# Altium project IFAT6.PrjPcb (part 2 of 3)

## Sheet Power.SchDoc: Power
size 762 x 381 mm; DrawnBy: Soumil Jain
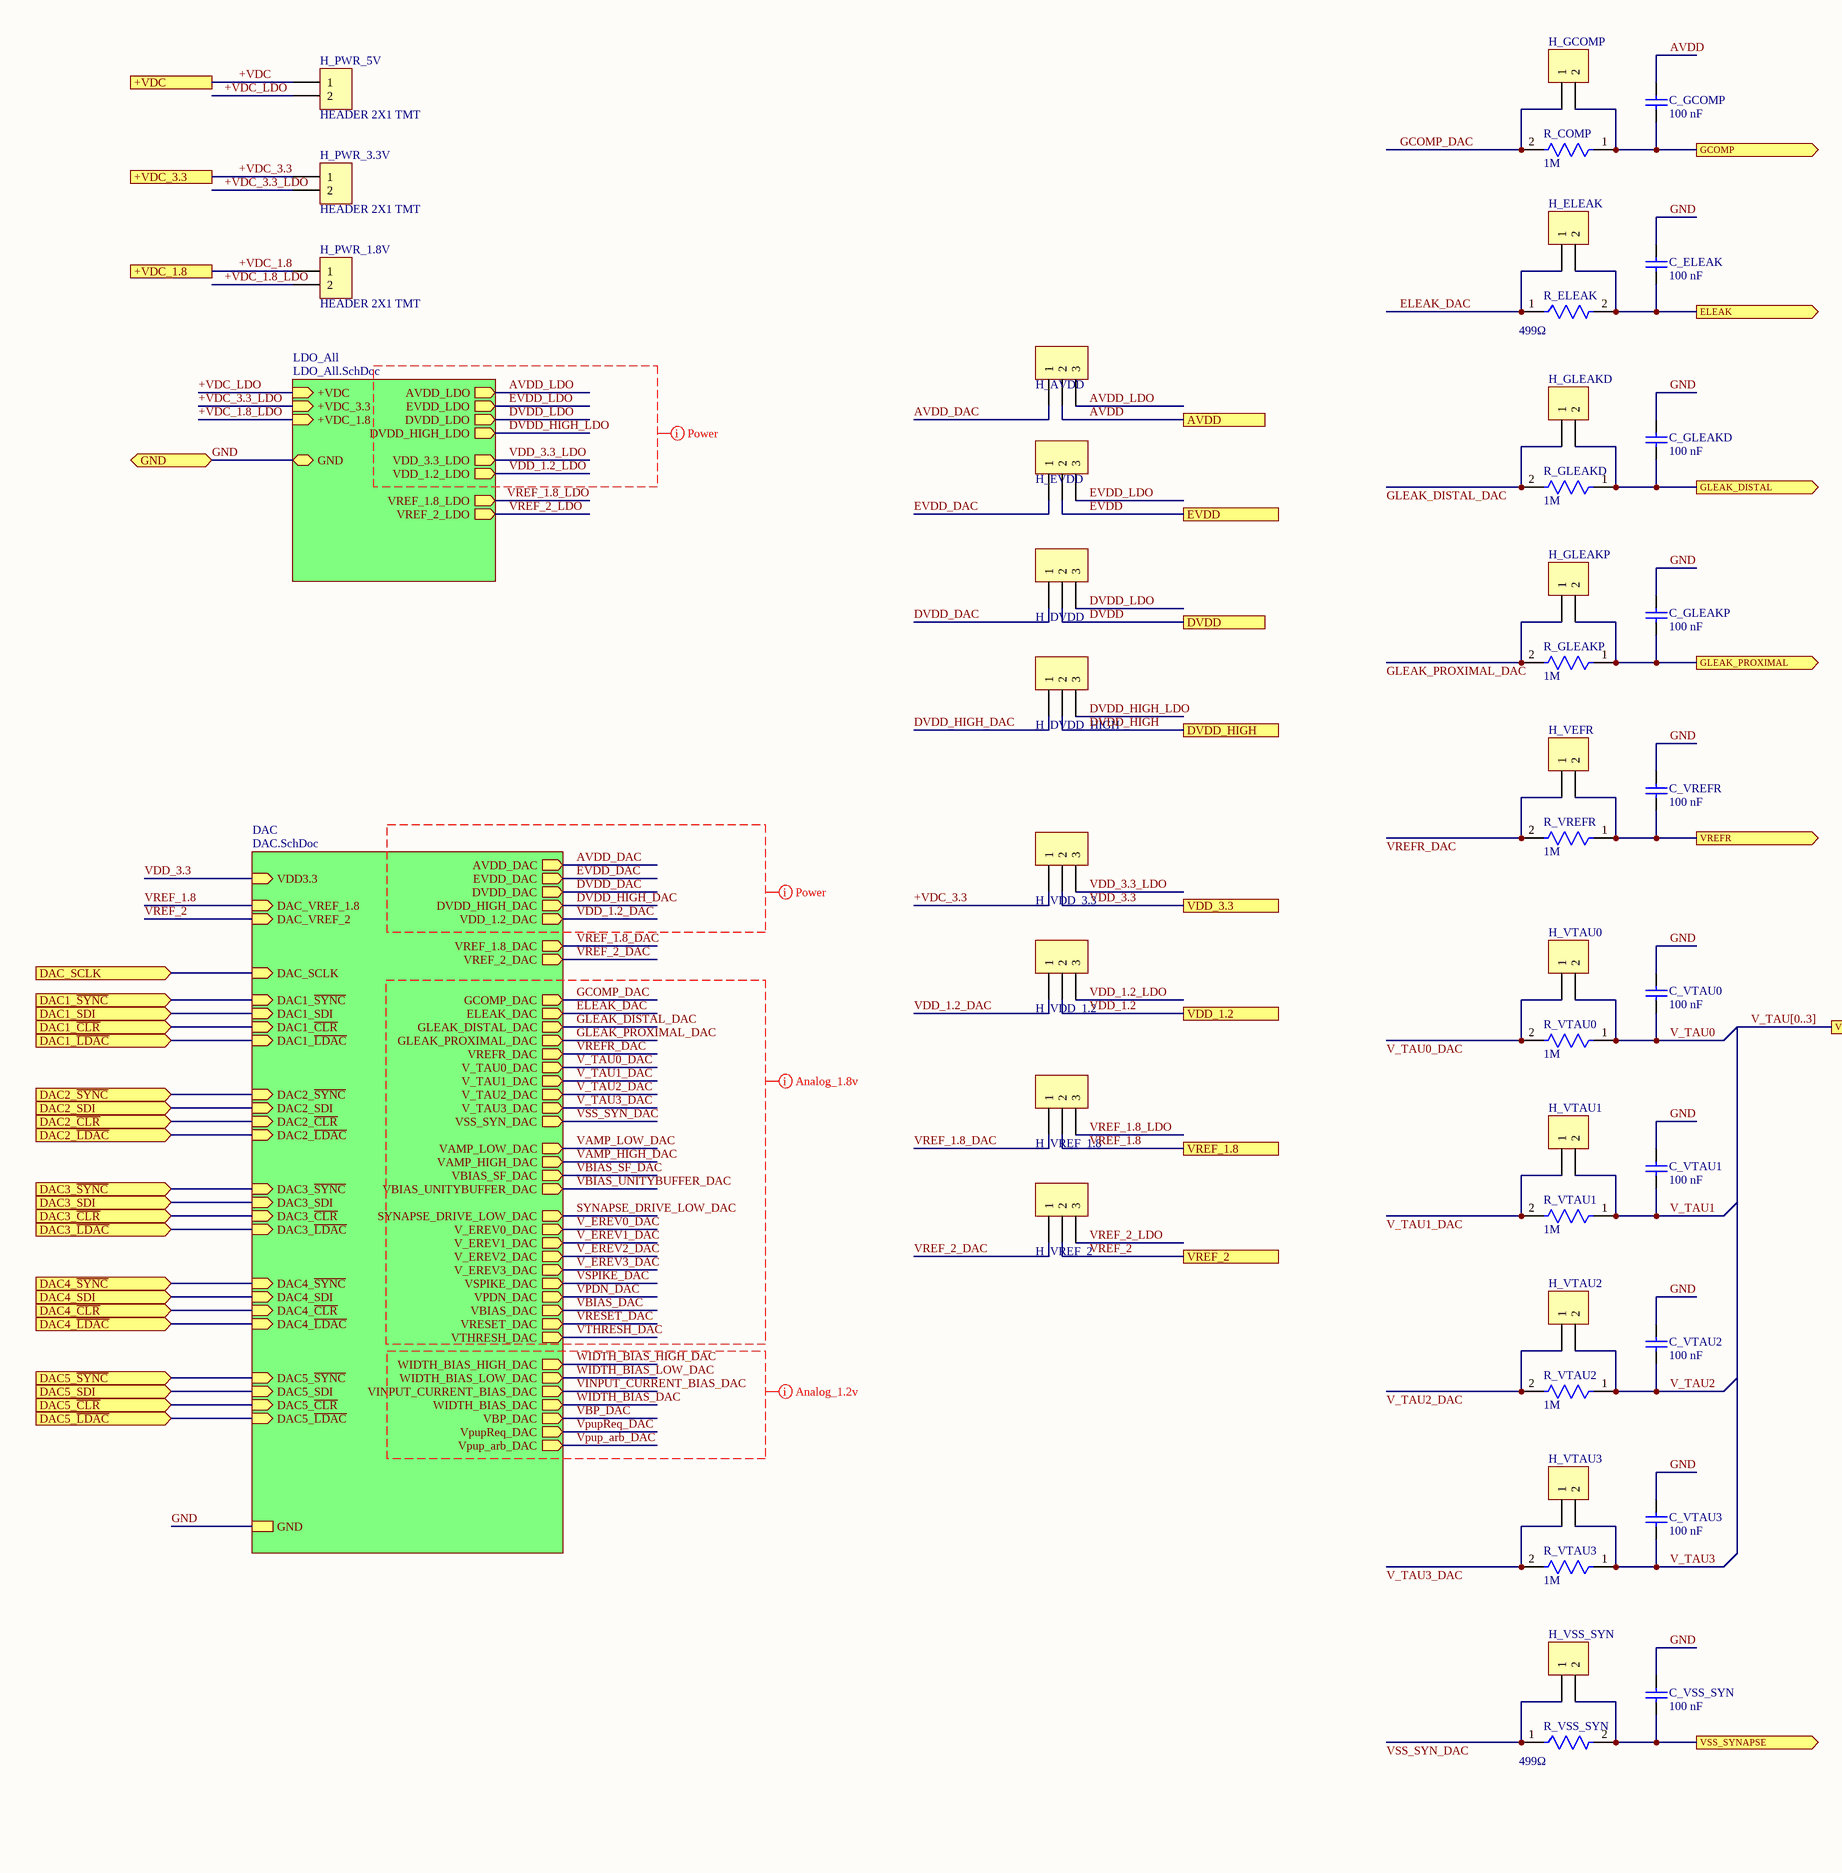
[diagram p4: Power.SchDoc, left]
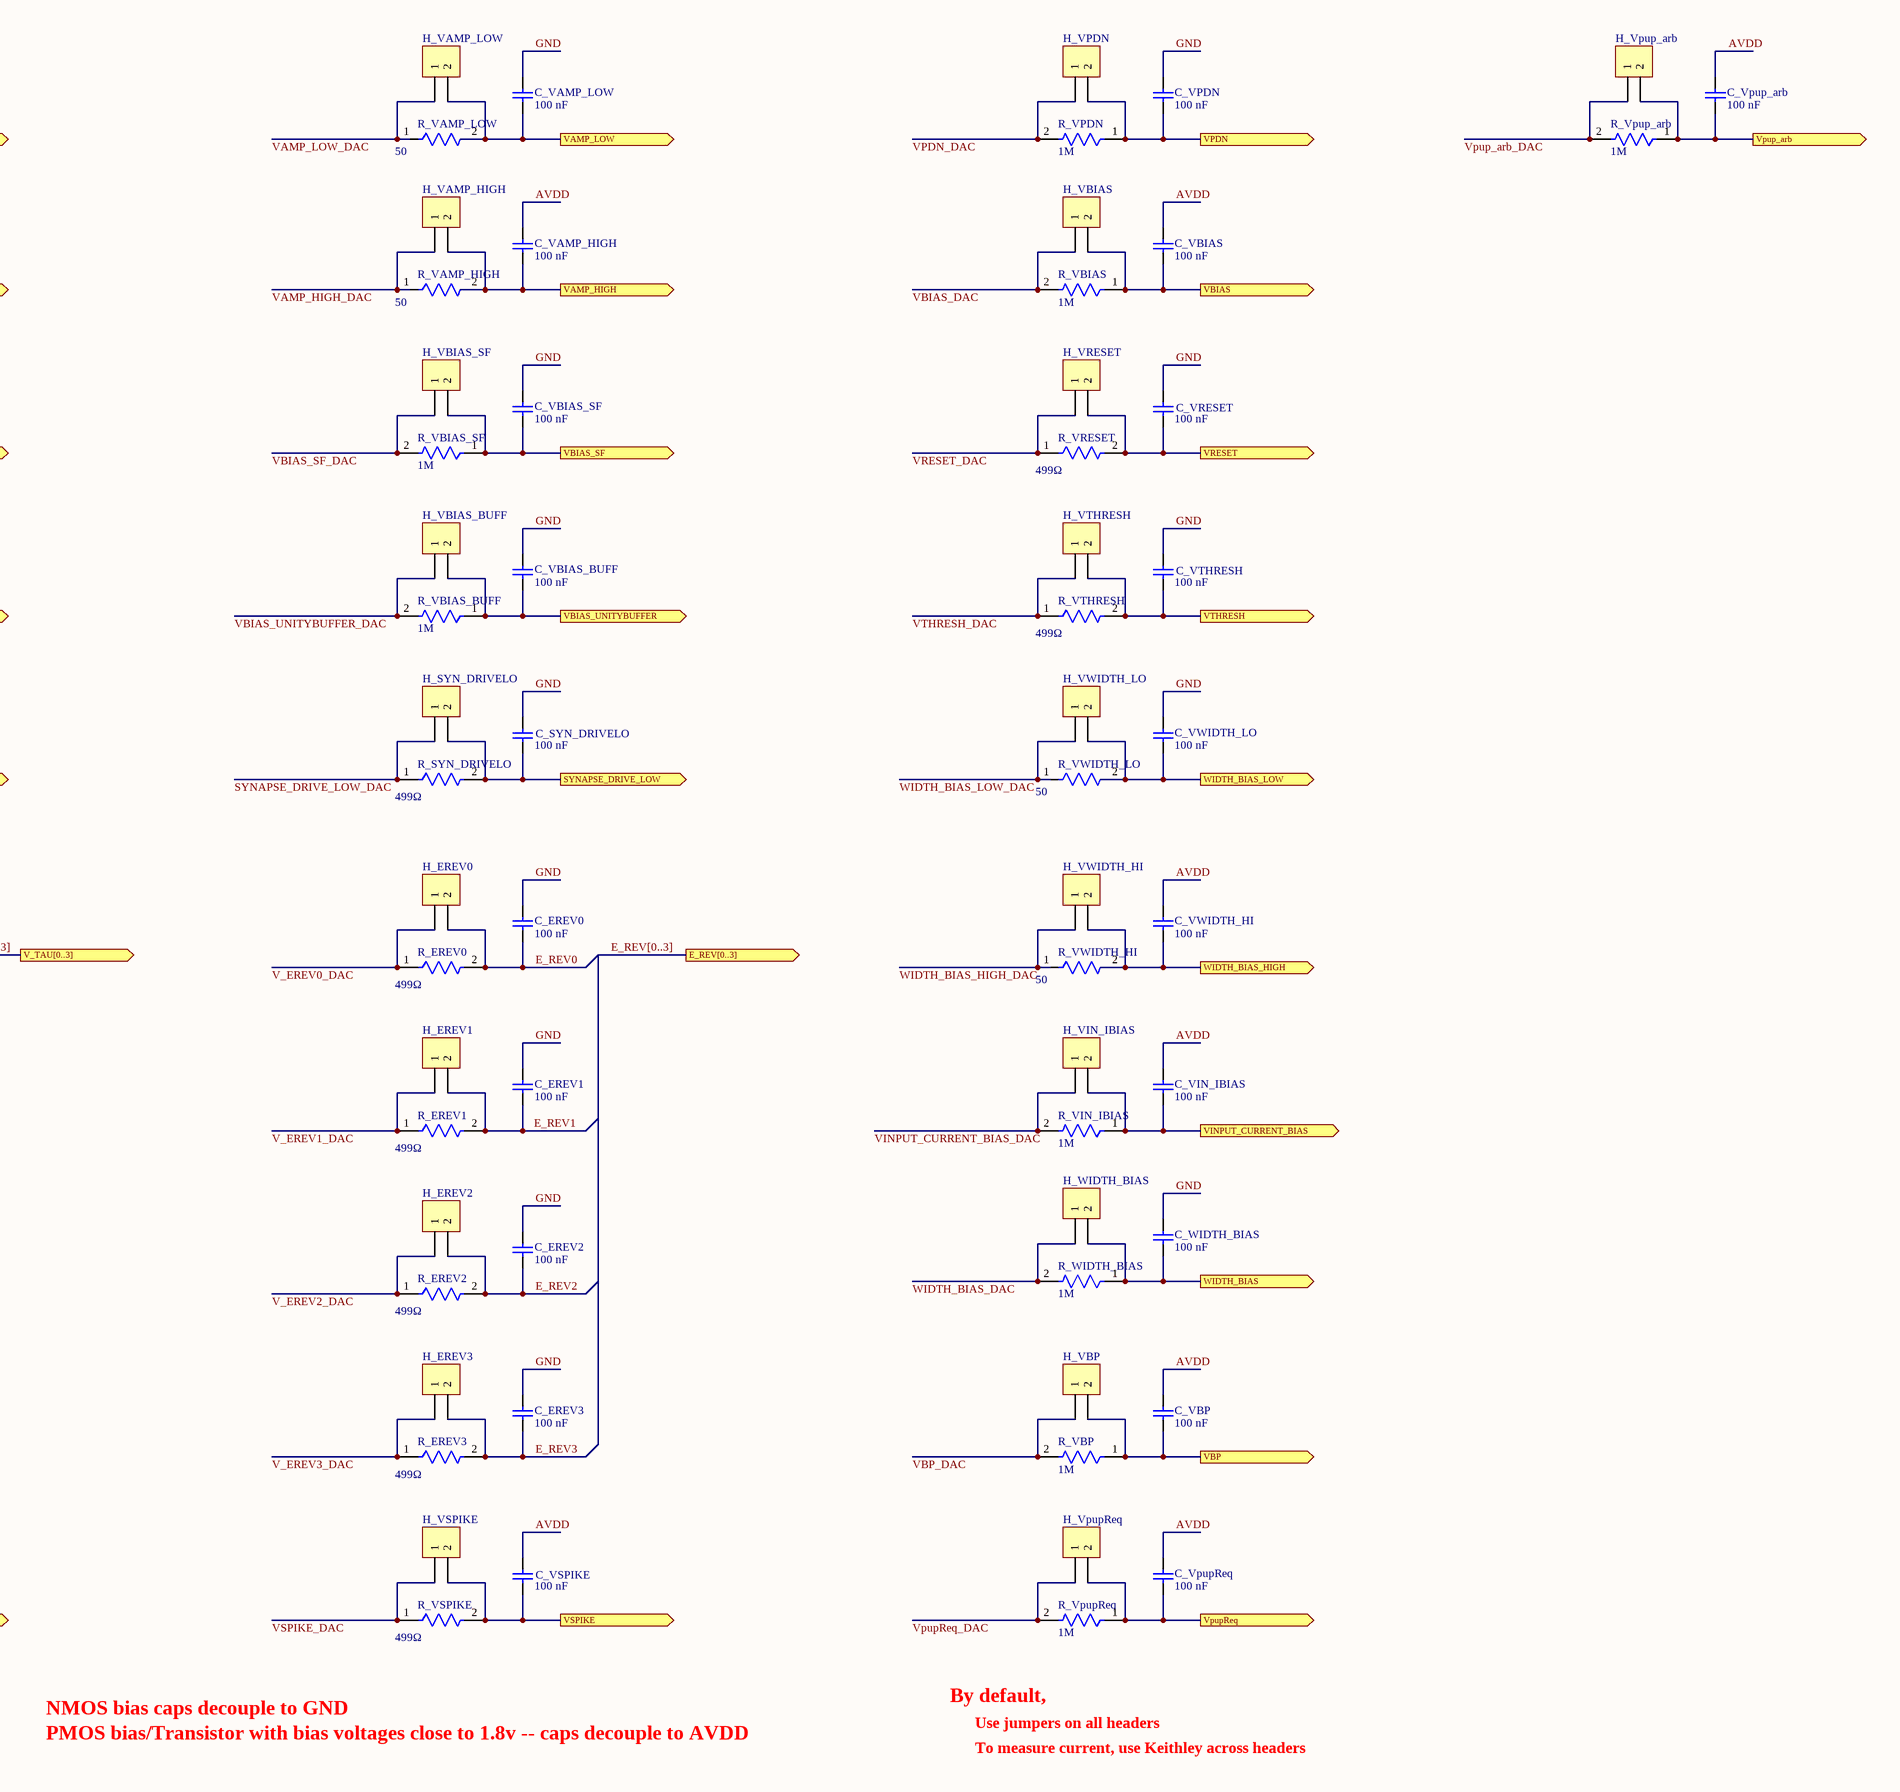
[diagram p5: Power.SchDoc, right]

### Parts
C_ELEAK  value 100 nF  [KEMET C0805C104J8RACTU]  (hidden comment: Cap 100nF 0805)
C_EREV0  value 100 nF  [KEMET C0805C104J8RACTU]  (hidden comment: Cap 100nF 0805)
C_EREV1  value 100 nF  [KEMET C0805C104J8RACTU]  (hidden comment: Cap 100nF 0805)
C_EREV2  value 100 nF  [KEMET C0805C104J8RACTU]  (hidden comment: Cap 100nF 0805)
C_EREV3  value 100 nF  [KEMET C0805C104J8RACTU]  (hidden comment: Cap 100nF 0805)
C_GCOMP  value 100 nF  [KEMET C0805C104J8RACTU]  (hidden comment: Cap 100nF 0805)
C_GLEAKD  value 100 nF  [KEMET C0805C104J8RACTU]  (hidden comment: Cap 100nF 0805)
C_GLEAKP  value 100 nF  [KEMET C0805C104J8RACTU]  (hidden comment: Cap 100nF 0805)
C_SYN_DRIVELO  value 100 nF  [KEMET C0805C104J8RACTU]  (hidden comment: Cap 100nF 0805)
C_VAMP_HIGH  value 100 nF  [KEMET C0805C104J8RACTU]  (hidden comment: Cap 100nF 0805)
C_VAMP_LOW  value 100 nF  [KEMET C0805C104J8RACTU]  (hidden comment: Cap 100nF 0805)
C_VBIAS  value 100 nF  [KEMET C0805C104J8RACTU]  (hidden comment: Cap 100nF 0805)
C_VBIAS_BUFF  value 100 nF  [KEMET C0805C104J8RACTU]  (hidden comment: Cap 100nF 0805)
C_VBIAS_SF  value 100 nF  [KEMET C0805C104J8RACTU]  (hidden comment: Cap 100nF 0805)
C_VBP  value 100 nF  [KEMET C0805C104J8RACTU]  (hidden comment: Cap 100nF 0805)
C_VIN_IBIAS  value 100 nF  [KEMET C0805C104J8RACTU]  (hidden comment: Cap 100nF 0805)
C_VPDN  value 100 nF  [KEMET C0805C104J8RACTU]  (hidden comment: Cap 100nF 0805)
C_Vpup_arb  value 100 nF  [KEMET C0805C104J8RACTU]  (hidden comment: Cap 100nF 0805)
C_VpupReq  value 100 nF  [KEMET C0805C104J8RACTU]  (hidden comment: Cap 100nF 0805)
C_VREFR  value 100 nF  [KEMET C0805C104J8RACTU]  (hidden comment: Cap 100nF 0805)
C_VRESET  value 100 nF  [KEMET C0805C104J8RACTU]  (hidden comment: Cap 100nF 0805)
C_VSPIKE  value 100 nF  [KEMET C0805C104J8RACTU]  (hidden comment: Cap 100nF 0805)
C_VSS_SYN  value 100 nF  [KEMET C0805C104J8RACTU]  (hidden comment: Cap 100nF 0805)
C_VTAU0  value 100 nF  [KEMET C0805C104J8RACTU]  (hidden comment: Cap 100nF 0805)
C_VTAU1  value 100 nF  [KEMET C0805C104J8RACTU]  (hidden comment: Cap 100nF 0805)
C_VTAU2  value 100 nF  [KEMET C0805C104J8RACTU]  (hidden comment: Cap 100nF 0805)
C_VTAU3  value 100 nF  [KEMET C0805C104J8RACTU]  (hidden comment: Cap 100nF 0805)
C_VTHRESH  value 100 nF  [KEMET C0805C104J8RACTU]  (hidden comment: Cap 100nF 0805)
C_VWIDTH_HI  value 100 nF  [KEMET C0805C104J8RACTU]  (hidden comment: Cap 100nF 0805)
C_VWIDTH_LO  value 100 nF  [KEMET C0805C104J8RACTU]  (hidden comment: Cap 100nF 0805)
C_WIDTH_BIAS  value 100 nF  [KEMET C0805C104J8RACTU]  (hidden comment: Cap 100nF 0805)
H_AVDD  HEADER 3X1 TMT  [Samtec TSW-103-07-L-S]  (value not drawn)
H_DVDD  HEADER 3X1 TMT  [Samtec TSW-103-07-L-S]  (value not drawn)
H_DVDD_HIGH  HEADER 3X1 TMT  [Samtec TSW-103-07-L-S]  (value not drawn)
H_ELEAK  HEADER 2X1 TMT  [Samtec TSW-102-07-G-S]  (value not drawn)
H_EREV0  HEADER 2X1 TMT  [Samtec TSW-102-07-G-S]  (value not drawn)
H_EREV1  HEADER 2X1 TMT  [Samtec TSW-102-07-G-S]  (value not drawn)
H_EREV2  HEADER 2X1 TMT  [Samtec TSW-102-07-G-S]  (value not drawn)
H_EREV3  HEADER 2X1 TMT  [Samtec TSW-102-07-G-S]  (value not drawn)
H_EVDD  HEADER 3X1 TMT  [Samtec TSW-103-07-L-S]  (value not drawn)
H_GCOMP  HEADER 2X1 TMT  [Samtec TSW-102-07-G-S]  (value not drawn)
H_GLEAKD  HEADER 2X1 TMT  [Samtec TSW-102-07-G-S]  (value not drawn)
H_GLEAKP  HEADER 2X1 TMT  [Samtec TSW-102-07-G-S]  (value not drawn)
H_PWR_1.8V  HEADER 2X1 TMT  [Samtec TSW-102-07-G-S]
H_PWR_3.3V  HEADER 2X1 TMT  [Samtec TSW-102-07-G-S]
H_PWR_5V  HEADER 2X1 TMT  [Samtec TSW-102-07-G-S]
H_SYN_DRIVELO  HEADER 2X1 TMT  [Samtec TSW-102-07-G-S]  (value not drawn)
H_VAMP_HIGH  HEADER 2X1 TMT  [Samtec TSW-102-07-G-S]  (value not drawn)
H_VAMP_LOW  HEADER 2X1 TMT  [Samtec TSW-102-07-G-S]  (value not drawn)
H_VBIAS  HEADER 2X1 TMT  [Samtec TSW-102-07-G-S]  (value not drawn)
H_VBIAS_BUFF  HEADER 2X1 TMT  [Samtec TSW-102-07-G-S]  (value not drawn)
H_VBIAS_SF  HEADER 2X1 TMT  [Samtec TSW-102-07-G-S]  (value not drawn)
H_VBP  HEADER 2X1 TMT  [Samtec TSW-102-07-G-S]  (value not drawn)
H_VDD_1.2  HEADER 3X1 TMT  [Samtec TSW-103-07-L-S]  (value not drawn)
H_VDD_3.3  HEADER 3X1 TMT  [Samtec TSW-103-07-L-S]  (value not drawn)
H_VEFR  HEADER 2X1 TMT  [Samtec TSW-102-07-G-S]  (value not drawn)
H_VIN_IBIAS  HEADER 2X1 TMT  [Samtec TSW-102-07-G-S]  (value not drawn)
H_VPDN  HEADER 2X1 TMT  [Samtec TSW-102-07-G-S]  (value not drawn)
H_Vpup_arb  HEADER 2X1 TMT  [Samtec TSW-102-07-G-S]  (value not drawn)
H_VpupReq  HEADER 2X1 TMT  [Samtec TSW-102-07-G-S]  (value not drawn)
H_VREF_1.8  HEADER 3X1 TMT  [Samtec TSW-103-07-L-S]  (value not drawn)
H_VREF_2  HEADER 3X1 TMT  [Samtec TSW-103-07-L-S]  (value not drawn)
H_VRESET  HEADER 2X1 TMT  [Samtec TSW-102-07-G-S]  (value not drawn)
H_VSPIKE  HEADER 2X1 TMT  [Samtec TSW-102-07-G-S]  (value not drawn)
H_VSS_SYN  HEADER 2X1 TMT  [Samtec TSW-102-07-G-S]  (value not drawn)
H_VTAU0  HEADER 2X1 TMT  [Samtec TSW-102-07-G-S]  (value not drawn)
H_VTAU1  HEADER 2X1 TMT  [Samtec TSW-102-07-G-S]  (value not drawn)
H_VTAU2  HEADER 2X1 TMT  [Samtec TSW-102-07-G-S]  (value not drawn)
H_VTAU3  HEADER 2X1 TMT  [Samtec TSW-102-07-G-S]  (value not drawn)
H_VTHRESH  HEADER 2X1 TMT  [Samtec TSW-102-07-G-S]  (value not drawn)
H_VWIDTH_HI  HEADER 2X1 TMT  [Samtec TSW-102-07-G-S]  (value not drawn)
H_VWIDTH_LO  HEADER 2X1 TMT  [Samtec TSW-102-07-G-S]  (value not drawn)
H_WIDTH_BIAS  HEADER 2X1 TMT  [Samtec TSW-102-07-G-S]  (value not drawn)
R_COMP  1M  [FP-CRCW0603-e3-MFG]
R_ELEAK  Resistance: 499Ω  [FP-RP73P-1J-MFG]  (hidden comment: RP73PF1J499RBTDF)
R_EREV0  Resistance: 499Ω  [FP-RP73P-1J-MFG]  (hidden comment: RP73PF1J499RBTDF)
R_EREV1  Resistance: 499Ω  [FP-RP73P-1J-MFG]  (hidden comment: RP73PF1J499RBTDF)
R_EREV2  Resistance: 499Ω  [FP-RP73P-1J-MFG]  (hidden comment: RP73PF1J499RBTDF)
R_EREV3  Resistance: 499Ω  [FP-RP73P-1J-MFG]  (hidden comment: RP73PF1J499RBTDF)
R_GLEAKD  1M  [FP-CRCW0603-e3-MFG]
R_GLEAKP  1M  [FP-CRCW0603-e3-MFG]
R_SYN_DRIVELO  Resistance: 499Ω  [FP-RP73P-1J-MFG]  (hidden comment: RP73PF1J499RBTDF)
R_VAMP_HIGH  RESISTANCE: 50  [FP-RN731E-IPC_A]  (hidden comment: RN731ETTP50R0F50)
R_VAMP_LOW  RESISTANCE: 50  [FP-RN731E-IPC_A]  (hidden comment: RN731ETTP50R0F50)
R_VBIAS  1M  [FP-CRCW0603-e3-MFG]
R_VBIAS_BUFF  1M  [FP-CRCW0603-e3-MFG]
R_VBIAS_SF  1M  [FP-CRCW0603-e3-MFG]
R_VBP  1M  [FP-CRCW0603-e3-MFG]
R_VIN_IBIAS  1M  [FP-CRCW0603-e3-MFG]
R_VPDN  1M  [FP-CRCW0603-e3-MFG]
R_Vpup_arb  1M  [FP-CRCW0603-e3-MFG]
R_VpupReq  1M  [FP-CRCW0603-e3-MFG]
R_VREFR  1M  [FP-CRCW0603-e3-MFG]
R_VRESET  Resistance: 499Ω  [FP-RP73P-1J-MFG]  (hidden comment: RP73PF1J499RBTDF)
R_VSPIKE  Resistance: 499Ω  [FP-RP73P-1J-MFG]  (hidden comment: RP73PF1J499RBTDF)
R_VSS_SYN  Resistance: 499Ω  [FP-RP73P-1J-MFG]  (hidden comment: RP73PF1J499RBTDF)
R_VTAU0  1M  [FP-CRCW0603-e3-MFG]
R_VTAU1  1M  [FP-CRCW0603-e3-MFG]
R_VTAU2  1M  [FP-CRCW0603-e3-MFG]
R_VTAU3  1M  [FP-CRCW0603-e3-MFG]
R_VTHRESH  Resistance: 499Ω  [FP-RP73P-1J-MFG]  (hidden comment: RP73PF1J499RBTDF)
R_VWIDTH_HI  RESISTANCE: 50  [FP-RN731E-IPC_A]  (hidden comment: RN731ETTP50R0F50)
R_VWIDTH_LO  RESISTANCE: 50  [FP-RN731E-IPC_A]  (hidden comment: RN731ETTP50R0F50)
R_WIDTH_BIAS  1M  [FP-CRCW0603-e3-MFG]

### Sub-sheets
DAC = DAC.SchDoc: DAC1_~{SYNC} (in), DAC_SCLK (in), DAC1_SDI (in), VDD3.3 (in), DAC_VREF_1.8 (in), EVDD_DAC (out), DAC1_~{CLR} (in), DAC1_~{LDAC} (in), GND, DAC2_~{SYNC} (in), DAC2_SDI (in), DAC2_~{CLR} (in), DAC2_~{LDAC} (in), AVDD_DAC (out), DVDD_DAC (out), DVDD_HIGH_DAC (out), VREF_1.8_DAC (out), GCOMP_DAC (out), ELEAK_DAC (out), GLEAK_DISTAL_DAC (out), GLEAK_PROXIMAL_DAC (out), VREFR_DAC (out), V_TAU0_DAC (out), V_TAU1_DAC (out), V_TAU2_DAC (out), V_TAU3_DAC (out), VSS_SYN_DAC (out), VAMP_LOW_DAC (out), VAMP_HIGH_DAC (out), VBIAS_SF_DAC (out), VBIAS_UNITYBUFFER_DAC (out), SYNAPSE_DRIVE_LOW_DAC (out), V_EREV0_DAC (out), V_EREV2_DAC (out), V_EREV1_DAC (out), V_EREV3_DAC (out), VSPIKE_DAC (out), VPDN_DAC (out), VBIAS_DAC (out), VRESET_DAC (out), VTHRESH_DAC (out), WIDTH_BIAS_HIGH_DAC (out), WIDTH_BIAS_LOW_DAC (out), VINPUT_CURRENT_BIAS_DAC (out), WIDTH_BIAS_DAC (out), VBP_DAC (out), VpupReq_DAC (out), Vpup_arb_DAC (out), DAC3_~{SYNC} (in), DAC3_SDI (in), DAC3_~{CLR} (in), DAC3_~{LDAC} (in), DAC_VREF_2 (in), VREF_2_DAC (out), DAC4_~{SYNC} (in), DAC4_SDI (in), DAC4_~{CLR} (in), DAC4_~{LDAC} (in), DAC5_~{LDAC} (in), DAC5_SDI (in), DAC5_~{SYNC} (in), DAC5_~{CLR} (in), VDD_1.2_DAC (out)
LDO_All = LDO_All.SchDoc: +VDC (in), GND (bidir), AVDD_LDO (out), DVDD_HIGH_LDO (out), EVDD_LDO (out), +VDC_3.3 (in), +VDC_1.8 (in), DVDD_LDO (out), VDD_3.3_LDO (out), VREF_1.8_LDO (out), VREF_2_LDO (out), VDD_1.2_LDO (out)

### Ports
+VDC, +VDC_1.8, +VDC_3.3, AVDD, DAC1_SDI (in), DAC1_~{CLR} (in), DAC1_~{LDAC} (in), DAC1_~{SYNC} (in), DAC2_SDI (in), DAC2_~{CLR} (in), DAC2_~{LDAC} (in), DAC2_~{SYNC} (in), DAC3_SDI (in), DAC3_~{CLR} (in), DAC3_~{LDAC} (in), DAC3_~{SYNC} (in), DAC4_SDI (in), DAC4_~{CLR} (in), DAC4_~{LDAC} (in), DAC4_~{SYNC} (in), DAC5_SDI (in), DAC5_~{CLR} (in), DAC5_~{LDAC} (in), DAC5_~{SYNC} (in), DAC_SCLK (in), DVDD, DVDD_HIGH, E_REV[0..3] (out), ELEAK (out), EVDD, GCOMP (out), GLEAK_DISTAL (out), GLEAK_PROXIMAL (out), GND (bidir), SYNAPSE_DRIVE_LOW (out), V_TAU[0..3] (out), VAMP_HIGH (out), VAMP_LOW (out), VBIAS (out), VBIAS_SF (out), VBIAS_UNITYBUFFER (out), VBP (out), VDD_1.2, VDD_3.3, VINPUT_CURRENT_BIAS (out), VPDN (out), Vpup_arb (out), VpupReq (out), VREF_1.8, VREF_2, VREFR (out), VRESET (out), VSPIKE (out), VSS_SYNAPSE (out), VTHRESH (out), WIDTH_BIAS (out), WIDTH_BIAS_HIGH (out), WIDTH_BIAS_LOW (out)

### Nets
+VDC: H_PWR_5V.1 ; port +VDC
+VDC_1.8: H_PWR_1.8V.1 ; port +VDC_1.8
+VDC_3.3: H_PWR_3.3V.1 H_VDD_3.3.1 ; port +VDC_3.3
GND: C_ELEAK.1 C_EREV0.1 C_EREV1.1 C_EREV2.1 C_EREV3.1 C_GLEAKD.1 C_GLEAKP.1 C_SYN_DRIVELO.1 C_VAMP_LOW.1 C_VBIAS_BUFF.1 C_VBIAS_SF.1 C_VPDN.1 C_VREFR.1 C_VRESET.1 C_VSS_SYN.1 C_VTAU0.1 C_VTAU1.1 C_VTAU2.1 C_VTAU3.1 C_VTHRESH.1 C_VWIDTH_LO.1 C_WIDTH_BIAS.1 ; port GND, sheet LDO_All/GND, sheet DAC/GND  [project net DGND]
VDD_1.2: H_VDD_1.2.2 ; port VDD_1.2  [project net VCCO_MC1]
+VDC_1.8_LDO: H_PWR_1.8V.2 ; sheet LDO_All/+VDC_1.8
+VDC_3.3_LDO: H_PWR_3.3V.2 ; sheet LDO_All/+VDC_3.3
+VDC_LDO: H_PWR_5V.2 ; sheet LDO_All/+VDC
AVDD: C_GCOMP.1 C_VAMP_HIGH.1 C_VBIAS.1 C_VBP.1 C_VIN_IBIAS.1 C_Vpup_arb.1 C_VpupReq.1 C_VSPIKE.1 C_VWIDTH_HI.1 H_AVDD.2 ; port AVDD
AVDD_DAC: H_AVDD.1 ; sheet DAC/AVDD_DAC
AVDD_LDO: H_AVDD.3 ; sheet LDO_All/AVDD_LDO
DAC1_~{CLR}: port DAC1_~{CLR}, sheet DAC/DAC1_~{CLR}
DAC1_~{LDAC}: port DAC1_~{LDAC}, sheet DAC/DAC1_~{LDAC}
DAC1_~{SYNC}: port DAC1_~{SYNC}, sheet DAC/DAC1_~{SYNC}
DAC1_SDI: port DAC1_SDI, sheet DAC/DAC1_SDI
DAC2_~{CLR}: port DAC2_~{CLR}, sheet DAC/DAC2_~{CLR}
DAC2_~{LDAC}: port DAC2_~{LDAC}, sheet DAC/DAC2_~{LDAC}
DAC2_~{SYNC}: port DAC2_~{SYNC}, sheet DAC/DAC2_~{SYNC}
DAC2_SDI: port DAC2_SDI, sheet DAC/DAC2_SDI
DAC3_~{CLR}: port DAC3_~{CLR}, sheet DAC/DAC3_~{CLR}
DAC3_~{LDAC}: port DAC3_~{LDAC}, sheet DAC/DAC3_~{LDAC}
DAC3_~{SYNC}: port DAC3_~{SYNC}, sheet DAC/DAC3_~{SYNC}
DAC3_SDI: port DAC3_SDI, sheet DAC/DAC3_SDI
DAC4_~{CLR}: port DAC4_~{CLR}, sheet DAC/DAC4_~{CLR}
DAC4_~{LDAC}: port DAC4_~{LDAC}, sheet DAC/DAC4_~{LDAC}
DAC4_~{SYNC}: port DAC4_~{SYNC}, sheet DAC/DAC4_~{SYNC}
DAC4_SDI: port DAC4_SDI, sheet DAC/DAC4_SDI
DAC5_~{CLR}: port DAC5_~{CLR}, sheet DAC/DAC5_~{CLR}
DAC5_~{LDAC}: port DAC5_~{LDAC}, sheet DAC/DAC5_~{LDAC}
DAC5_~{SYNC}: port DAC5_~{SYNC}, sheet DAC/DAC5_~{SYNC}
DAC5_SDI: port DAC5_SDI, sheet DAC/DAC5_SDI
DAC_SCLK: port DAC_SCLK, sheet DAC/DAC_SCLK
DVDD: H_DVDD.2 ; port DVDD
DVDD_DAC: H_DVDD.1 ; sheet DAC/DVDD_DAC
DVDD_HIGH: H_DVDD_HIGH.2 ; port DVDD_HIGH
DVDD_HIGH_DAC: H_DVDD_HIGH.1 ; sheet DAC/DVDD_HIGH_DAC
DVDD_HIGH_LDO: H_DVDD_HIGH.3 ; sheet LDO_All/DVDD_HIGH_LDO
DVDD_LDO: H_DVDD.3 ; sheet LDO_All/DVDD_LDO
E_REV0: C_EREV0.2 H_EREV0.2 R_EREV0.2
E_REV1: C_EREV1.2 H_EREV1.2 R_EREV1.2
E_REV2: C_EREV2.2 H_EREV2.2 R_EREV2.2
E_REV3: C_EREV3.2 H_EREV3.2 R_EREV3.2
ELEAK: C_ELEAK.2 H_ELEAK.2 R_ELEAK.2 ; port ELEAK
ELEAK_DAC: H_ELEAK.1 R_ELEAK.1 ; sheet DAC/ELEAK_DAC
EVDD: H_EVDD.2 ; port EVDD
EVDD_DAC: H_EVDD.1 ; sheet DAC/EVDD_DAC
EVDD_LDO: H_EVDD.3 ; sheet LDO_All/EVDD_LDO
GCOMP: C_GCOMP.2 H_GCOMP.2 R_COMP.1 ; port GCOMP
GCOMP_DAC: H_GCOMP.1 R_COMP.2 ; sheet DAC/GCOMP_DAC
GLEAK_DISTAL: C_GLEAKD.2 H_GLEAKD.2 R_GLEAKD.1 ; port GLEAK_DISTAL
GLEAK_DISTAL_DAC: H_GLEAKD.1 R_GLEAKD.2 ; sheet DAC/GLEAK_DISTAL_DAC
GLEAK_PROXIMAL: C_GLEAKP.2 H_GLEAKP.2 R_GLEAKP.1 ; port GLEAK_PROXIMAL
GLEAK_PROXIMAL_DAC: H_GLEAKP.1 R_GLEAKP.2 ; sheet DAC/GLEAK_PROXIMAL_DAC
SYNAPSE_DRIVE_LOW: C_SYN_DRIVELO.2 H_SYN_DRIVELO.2 R_SYN_DRIVELO.2 ; port SYNAPSE_DRIVE_LOW
SYNAPSE_DRIVE_LOW_DAC: H_SYN_DRIVELO.1 R_SYN_DRIVELO.1 ; sheet DAC/SYNAPSE_DRIVE_LOW_DAC
V_EREV0_DAC: H_EREV0.1 R_EREV0.1 ; sheet DAC/V_EREV0_DAC
V_EREV1_DAC: H_EREV1.1 R_EREV1.1 ; sheet DAC/V_EREV1_DAC
V_EREV2_DAC: H_EREV2.1 R_EREV2.1 ; sheet DAC/V_EREV2_DAC
V_EREV3_DAC: H_EREV3.1 R_EREV3.1 ; sheet DAC/V_EREV3_DAC
V_TAU0: C_VTAU0.2 H_VTAU0.2 R_VTAU0.1
V_TAU0_DAC: H_VTAU0.1 R_VTAU0.2 ; sheet DAC/V_TAU0_DAC
V_TAU1: C_VTAU1.2 H_VTAU1.2 R_VTAU1.1
V_TAU1_DAC: H_VTAU1.1 R_VTAU1.2 ; sheet DAC/V_TAU1_DAC
V_TAU2: C_VTAU2.2 H_VTAU2.2 R_VTAU2.1
V_TAU2_DAC: H_VTAU2.1 R_VTAU2.2 ; sheet DAC/V_TAU2_DAC
V_TAU3: C_VTAU3.2 H_VTAU3.2 R_VTAU3.1
V_TAU3_DAC: H_VTAU3.1 R_VTAU3.2 ; sheet DAC/V_TAU3_DAC
VAMP_HIGH: C_VAMP_HIGH.2 H_VAMP_HIGH.2 R_VAMP_HIGH.2 ; port VAMP_HIGH
VAMP_HIGH_DAC: H_VAMP_HIGH.1 R_VAMP_HIGH.1 ; sheet DAC/VAMP_HIGH_DAC
VAMP_LOW: C_VAMP_LOW.2 H_VAMP_LOW.2 R_VAMP_LOW.2 ; port VAMP_LOW
VAMP_LOW_DAC: H_VAMP_LOW.1 R_VAMP_LOW.1 ; sheet DAC/VAMP_LOW_DAC
VBIAS: C_VBIAS.2 H_VBIAS.2 R_VBIAS.1 ; port VBIAS
VBIAS_DAC: H_VBIAS.1 R_VBIAS.2 ; sheet DAC/VBIAS_DAC
VBIAS_SF: C_VBIAS_SF.2 H_VBIAS_SF.2 R_VBIAS_SF.1 ; port VBIAS_SF
VBIAS_SF_DAC: H_VBIAS_SF.1 R_VBIAS_SF.2 ; sheet DAC/VBIAS_SF_DAC
VBIAS_UNITYBUFFER: C_VBIAS_BUFF.2 H_VBIAS_BUFF.2 R_VBIAS_BUFF.1 ; port VBIAS_UNITYBUFFER
VBIAS_UNITYBUFFER_DAC: H_VBIAS_BUFF.1 R_VBIAS_BUFF.2 ; sheet DAC/VBIAS_UNITYBUFFER_DAC
VBP: C_VBP.2 H_VBP.2 R_VBP.1 ; port VBP
VBP_DAC: H_VBP.1 R_VBP.2 ; sheet DAC/VBP_DAC
VDD_1.2_DAC: H_VDD_1.2.1 ; sheet DAC/VDD_1.2_DAC
VDD_1.2_LDO: H_VDD_1.2.3 ; sheet LDO_All/VDD_1.2_LDO
VDD_3.3: H_VDD_3.3.2 ; port VDD_3.3, sheet DAC/VDD3.3  [project net VDD3.3]
VDD_3.3_LDO: H_VDD_3.3.3 ; sheet LDO_All/VDD_3.3_LDO
VINPUT_CURRENT_BIAS: C_VIN_IBIAS.2 H_VIN_IBIAS.2 R_VIN_IBIAS.1 ; port VINPUT_CURRENT_BIAS
VINPUT_CURRENT_BIAS_DAC: H_VIN_IBIAS.1 R_VIN_IBIAS.2 ; sheet DAC/VINPUT_CURRENT_BIAS_DAC
VPDN: C_VPDN.2 H_VPDN.2 R_VPDN.1 ; port VPDN
VPDN_DAC: H_VPDN.1 R_VPDN.2 ; sheet DAC/VPDN_DAC
Vpup_arb: C_Vpup_arb.2 H_Vpup_arb.2 R_Vpup_arb.1 ; port Vpup_arb
Vpup_arb_DAC: H_Vpup_arb.1 R_Vpup_arb.2 ; sheet DAC/Vpup_arb_DAC
VpupReq: C_VpupReq.2 H_VpupReq.2 R_VpupReq.1 ; port VpupReq
VpupReq_DAC: H_VpupReq.1 R_VpupReq.2 ; sheet DAC/VpupReq_DAC
VREF_1.8: H_VREF_1.8.2 ; port VREF_1.8, sheet DAC/DAC_VREF_1.8  [project net DAC_VREF_1.8]
VREF_1.8_DAC: H_VREF_1.8.1 ; sheet DAC/VREF_1.8_DAC
VREF_1.8_LDO: H_VREF_1.8.3 ; sheet LDO_All/VREF_1.8_LDO
VREF_2: H_VREF_2.2 ; port VREF_2, sheet DAC/DAC_VREF_2  [project net DAC_VREF_2]
VREF_2_DAC: H_VREF_2.1 ; sheet DAC/VREF_2_DAC
VREF_2_LDO: H_VREF_2.3 ; sheet LDO_All/VREF_2_LDO
VREFR: C_VREFR.2 H_VEFR.2 R_VREFR.1 ; port VREFR
VREFR_DAC: H_VEFR.1 R_VREFR.2 ; sheet DAC/VREFR_DAC
VRESET: C_VRESET.2 H_VRESET.2 R_VRESET.2 ; port VRESET
VRESET_DAC: H_VRESET.1 R_VRESET.1 ; sheet DAC/VRESET_DAC
VSPIKE: C_VSPIKE.2 H_VSPIKE.2 R_VSPIKE.2 ; port VSPIKE
VSPIKE_DAC: H_VSPIKE.1 R_VSPIKE.1 ; sheet DAC/VSPIKE_DAC
VSS_SYN_DAC: H_VSS_SYN.1 R_VSS_SYN.1 ; sheet DAC/VSS_SYN_DAC
VSS_SYNAPSE: C_VSS_SYN.2 H_VSS_SYN.2 R_VSS_SYN.2 ; port VSS_SYNAPSE
VTHRESH: C_VTHRESH.2 H_VTHRESH.2 R_VTHRESH.2 ; port VTHRESH
VTHRESH_DAC: H_VTHRESH.1 R_VTHRESH.1 ; sheet DAC/VTHRESH_DAC
WIDTH_BIAS: C_WIDTH_BIAS.2 H_WIDTH_BIAS.2 R_WIDTH_BIAS.1 ; port WIDTH_BIAS
WIDTH_BIAS_DAC: H_WIDTH_BIAS.1 R_WIDTH_BIAS.2 ; sheet DAC/WIDTH_BIAS_DAC
WIDTH_BIAS_HIGH: C_VWIDTH_HI.2 H_VWIDTH_HI.2 R_VWIDTH_HI.2 ; port WIDTH_BIAS_HIGH
WIDTH_BIAS_HIGH_DAC: H_VWIDTH_HI.1 R_VWIDTH_HI.1 ; sheet DAC/WIDTH_BIAS_HIGH_DAC
WIDTH_BIAS_LOW: C_VWIDTH_LO.2 H_VWIDTH_LO.2 R_VWIDTH_LO.2 ; port WIDTH_BIAS_LOW
WIDTH_BIAS_LOW_DAC: H_VWIDTH_LO.1 R_VWIDTH_LO.1 ; sheet DAC/WIDTH_BIAS_LOW_DAC

### Buses and harness runs
bus E_REV[0..3] = port E_REV[0..3]
bus V_TAU[0..3] = port V_TAU[0..3]

### Layout directives
mark named Power: AVDD_DAC, AVDD_LDO, DVDD_DAC, DVDD_HIGH_DAC, DVDD_HIGH_LDO, DVDD_LDO, EVDD_DAC, EVDD_LDO, VDD_1.2_DAC, VDD_1.2_LDO, VDD_3.3_LDO
mark named Analog_1.8v: ELEAK_DAC, GCOMP_DAC, GLEAK_DISTAL_DAC, GLEAK_PROXIMAL_DAC, SYNAPSE_DRIVE_LOW_DAC, V_EREV0_DAC, V_EREV1_DAC, V_EREV2_DAC, V_EREV3_DAC, V_TAU0_DAC, V_TAU1_DAC, V_TAU2_DAC, V_TAU3_DAC, VAMP_HIGH_DAC, VAMP_LOW_DAC, VBIAS_DAC, VBIAS_SF_DAC, VBIAS_UNITYBUFFER_DAC, VPDN_DAC, VREFR_DAC, VRESET_DAC, VSPIKE_DAC, VSS_SYN_DAC, VTHRESH_DAC
mark named Analog_1.2v: VBP_DAC, VINPUT_CURRENT_BIAS_DAC, Vpup_arb_DAC, VpupReq_DAC, WIDTH_BIAS_DAC, WIDTH_BIAS_HIGH_DAC, WIDTH_BIAS_LOW_DAC

### Notes on the sheet
- NMOS bias caps decouple to GND
- PMOS bias/Transistor with bias voltages close to 1.8v -- caps decouple to AVDD
- By default,
- Use jumpers on all headers
- To measure current, use Keithley across headers

### Library data of the parts
C_ELEAK C_EREV0-C_EREV3 C_GCOMP C_GLEAKD C_GLEAKP C_SYN_DRIVELO C_VAMP_HIGH C_VAMP_LOW C_VBIAS C_VBIAS_BUFF C_VBIAS_SF C_VBP C_VIN_IBIAS C_VPDN C_Vpup_arb C_VpupReq C_VREFR C_VRESET C_VSPIKE C_VSS_SYN C_VTAU0-C_VTAU3 C_VTHRESH C_VWIDTH_HI C_VWIDTH_LO C_WIDTH_BIAS = Cap 100nF 0805: CAP CER 0.1UF 10V X7R 0805 / ±10% 10V Ceramic Capacitor X7R 0805 (2012 Metric); Supplier 1: Digi-Key; Supplier Part Number 1: 478-5311-1-ND
H_AVDD H_DVDD H_DVDD_HIGH H_EVDD H_VDD_1.2 H_VDD_3.3 H_VREF_1.8 H_VREF_2 = HEADER 3X1 TMT: CONN HEADER VERT 3POS 2.54MM / Connector Header Through Hole 3 position 0.100" (2.54mm); Supplier 1: Digi-Key; Supplier Part Number 1: SAM1031-03-ND
H_ELEAK H_EREV0-H_EREV3 H_GCOMP H_GLEAKD H_GLEAKP H_PWR_1.8V H_PWR_3.3V H_PWR_5V H_SYN_DRIVELO H_VAMP_HIGH H_VAMP_LOW H_VBIAS H_VBIAS_BUFF H_VBIAS_SF H_VBP H_VEFR H_VIN_IBIAS H_VPDN H_Vpup_arb H_VpupReq H_VRESET H_VSPIKE H_VSS_SYN H_VTAU0-H_VTAU3 H_VTHRESH H_VWIDTH_HI H_VWIDTH_LO H_WIDTH_BIAS = HEADER 2X1 TMT: CONN HEADER VERT 2POS 2.54MM / Connector Header Through Hole 2 position 0.100" (2.54mm); Supplier 1: Digi-Key; Supplier Part Number 1: SAM1029-02-ND
R_COMP R_GLEAKD R_GLEAKP R_VBIAS R_VBIAS_BUFF R_VBIAS_SF R_VBP R_VIN_IBIAS R_VPDN R_Vpup_arb R_VpupReq R_VREFR R_VTAU0-R_VTAU3 R_WIDTH_BIAS = CMP-2000-03013-2: RES Thick Film, 1MΩ, 1%, 0.1W, 100ppm/°C, 0603; Max Power Dissipation: 100mW; Resistance: 1MR; Voltage Rating (DC): 75V; Depth: 0.85mm; Max Operating Temperature: 155°C; Length: 1.55mm; Power Rating: 100mW; Military Standard: Not; Features: Automotive AEC-Q200; Min Operating Temperature: -55°C; Number of Pins: 2; Mount: Surface Mount; Package Quantity: 10; Packaging: Tape and Reel; Height: 0.45mm; Radiation Hardening: No; Case Code (Metric): 1608; Temperature Coefficient: 100ppm/°C; Width: 0.85mm; Composition: Thick Film; Termination: SMD/SMT; Tolerance: 1%; Number of Terminations: 2; Lead Free: Lead Free; Contact Plating: Tin; Case/Package: 0603; Weight: 7.1E-05oz; Voltage Rating: 75V; Case Code (Imperial): 0603
R_ELEAK R_EREV0-R_EREV3 R_SYN_DRIVELO R_VRESET R_VSPIKE R_VSS_SYN R_VTHRESH = CMP-03211-011223-1: RES SMD 499 OHM 0.1% 1/6W 0603; Manufacturer: TE Connectivity; Tolerance: 0.001; Description: RP73P 0603 499Ω 0.166W 25ppm/°C 0.10% 100V; Voltage Rating: 100V; Value: 499Ω; Power Rating: 0.166W; Temperature Coefficient: 25ppm/°C; Device Class L3: Chip SMD Resistors; Device Class L2: Resistors; Temperature Range High: +155°C; Octopart: https://octopart.com/rp73pf1j499rbtdf-te+connectivity-45466091; Height: 0.55mm; Series: RP73P; RoHS: TRUE; Category: Res; Lead Free: Yes; Temperature: -55°C to +155°C; Digikey Description: RES SMD 499 OHM 0.1% 1/6W 0603; Temperature Range Low: -55°C; Mouser Description: Thin Film Resistors - SMD RP 1J 0.166W 499R 0.1% 25PPM 1K RL; ComponentLink2Description: Datasheet; Automotive: No; Package: RP73P-1J; Manufacturer Part Number: RP73PF1J499RBTDF; ComponentLink2URL: https://www.te.com/commerce/DocumentDelivery/DDEController?Action=srchrtrv&DocNm=1773272&DocType=DS&DocLang=English; Device Class L1: Passive Components; Composition: Thin Film; Ipc Land Pattern Name: RESC15580X45
R_VAMP_HIGH R_VAMP_LOW R_VWIDTH_HI R_VWIDTH_LO = CMP-04015-013028-1: 50Ω ±1% 0.063W, 1/16W Chip Resistor 0402 (1005 Metric) Moisture Resistant Thin Film

## Sheet LDO_All.SchDoc
size B
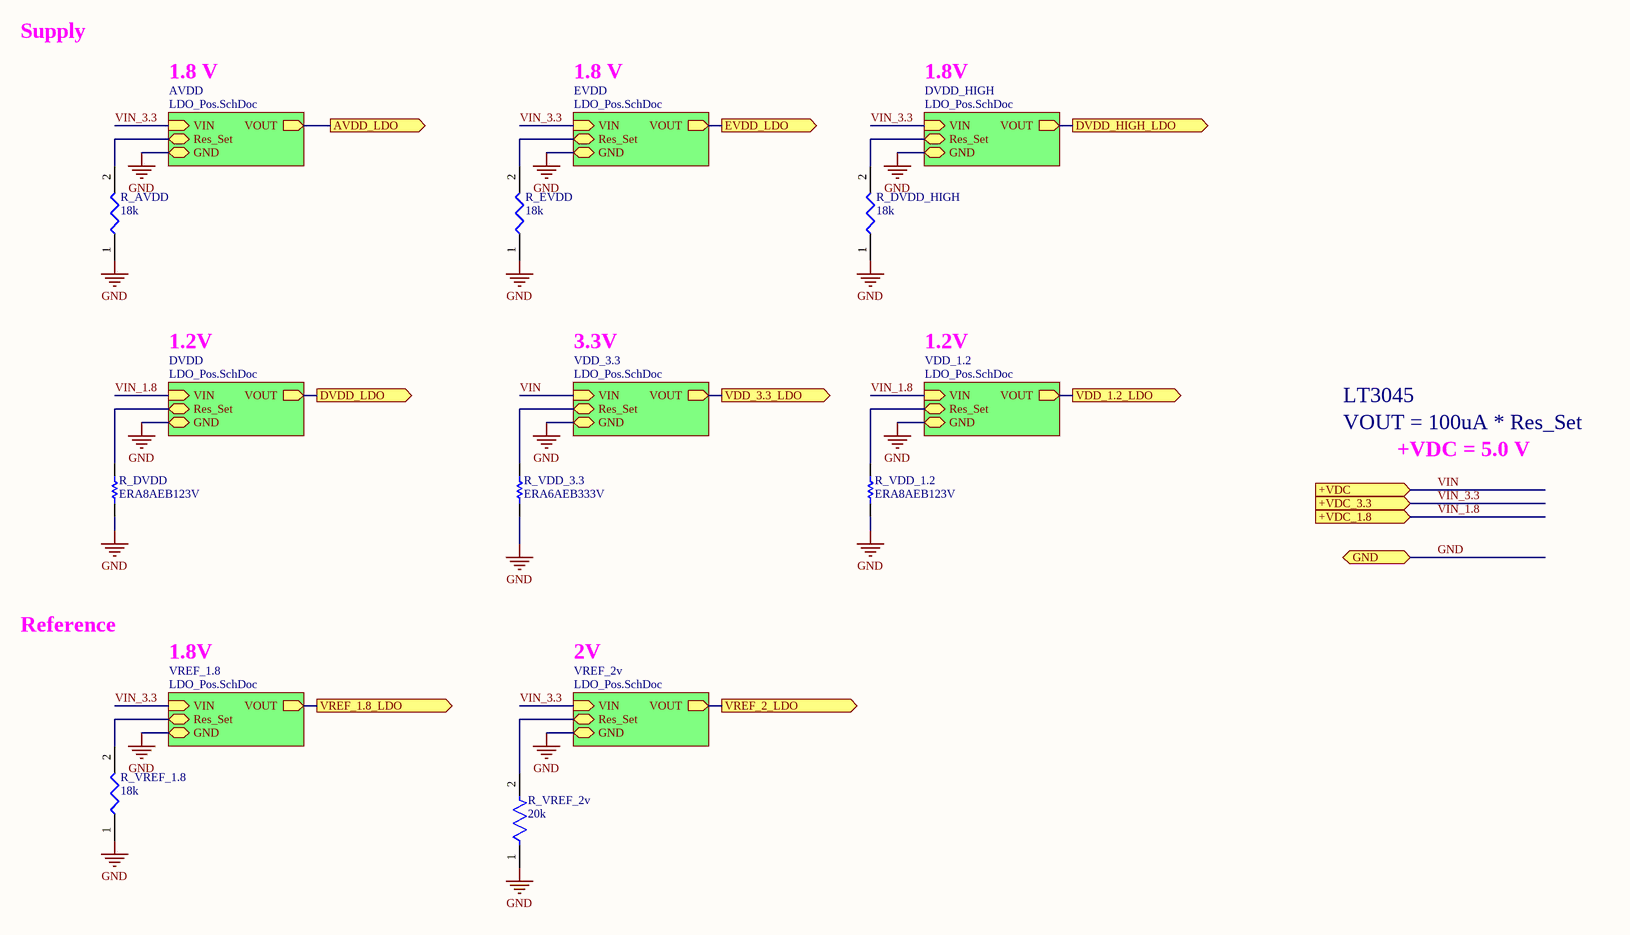
[diagram p6: LDO_All.SchDoc]

### Parts
R_AVDD  18k  [ERA3KV_(0603)]
R_DVDD  ERA8AEB123V  [RESC3216X70X50NL20T25]
R_DVDD_HIGH  18k  [ERA3KV_(0603)]
R_EVDD  18k  [ERA3KV_(0603)]
R_VDD_1.2  ERA8AEB123V  [RESC3216X70X50NL20T25]
R_VDD_3.3  ERA6AEB333V  [RESC2013X60X40NL20T25]
R_VREF_1.8  18k  [ERA3KV_(0603)]
R_VREF_2v  20k  [FP-RT0603-MFG]

### Sub-sheets
AVDD = LDO_Pos.SchDoc: VOUT (out), VIN (in), Res_Set (bidir), GND (bidir)
DVDD = LDO_Pos.SchDoc: VOUT (out), VIN (in), Res_Set (bidir), GND (bidir)
DVDD_HIGH = LDO_Pos.SchDoc: VOUT (out), VIN (in), Res_Set (bidir), GND (bidir)
EVDD = LDO_Pos.SchDoc: VOUT (out), VIN (in), Res_Set (bidir), GND (bidir)
VDD_1.2 = LDO_Pos.SchDoc: VOUT (out), VIN (in), Res_Set (bidir), GND (bidir)
VDD_3.3 = LDO_Pos.SchDoc: VOUT (out), VIN (in), Res_Set (bidir), GND (bidir)
VREF_1.8 = LDO_Pos.SchDoc: VOUT (out), VIN (in), Res_Set (bidir), GND (bidir)
VREF_2v = LDO_Pos.SchDoc: VOUT (out), VIN (in), Res_Set (bidir), GND (bidir)

### Ports
+VDC (in), +VDC_1.8 (in), +VDC_3.3 (in), AVDD_LDO (out), DVDD_HIGH_LDO (out), DVDD_LDO (out), EVDD_LDO (out), GND (bidir), VDD_1.2_LDO (out), VDD_3.3_LDO (out), VREF_1.8_LDO (out), VREF_2_LDO (out)

### Nets
GND: R_AVDD.1 R_DVDD.1 R_DVDD_HIGH.1 R_EVDD.1 R_VDD_1.2.1 R_VDD_3.3.1 R_VREF_1.8.1 R_VREF_2v.1 ; port GND, sheet AVDD/GND, sheet DVDD_HIGH/GND, sheet EVDD/GND, sheet DVDD/GND, sheet VDD_3.3/GND, sheet VREF_2v/GND, sheet VREF_1.8/GND, sheet VDD_1.2/GND  [project net DGND]
AVDD_LDO: port AVDD_LDO, sheet AVDD/VOUT
DVDD_HIGH_LDO: port DVDD_HIGH_LDO, sheet DVDD_HIGH/VOUT
DVDD_LDO: port DVDD_LDO, sheet DVDD/VOUT
EVDD_LDO: port EVDD_LDO, sheet EVDD/VOUT
VDD_1.2_LDO: port VDD_1.2_LDO, sheet VDD_1.2/VOUT
VDD_3.3_LDO: port VDD_3.3_LDO, sheet VDD_3.3/VOUT
VIN: port +VDC, sheet VDD_3.3/VIN  [project net +VDC_LDO]
VIN_1.8: port +VDC_1.8, sheet DVDD/VIN, sheet VDD_1.2/VIN  [project net +VDC_1.8_LDO]
VIN_3.3: port +VDC_3.3, sheet AVDD/VIN, sheet DVDD_HIGH/VIN, sheet EVDD/VIN, sheet VREF_2v/VIN, sheet VREF_1.8/VIN  [project net +VDC_3.3_LDO]
VREF_1.8_LDO: port VREF_1.8_LDO, sheet VREF_1.8/VOUT
VREF_2_LDO: port VREF_2_LDO, sheet VREF_2v/VOUT
NetC_3_AVDD_1: R_AVDD.2 ; sheet AVDD/Res_Set
NetC_3_DVDD_1: R_DVDD.2 ; sheet DVDD/Res_Set
NetC_3_DVDD_HIGH_1: R_DVDD_HIGH.2 ; sheet DVDD_HIGH/Res_Set
NetC_3_EVDD_1: R_EVDD.2 ; sheet EVDD/Res_Set
NetC_3_VDD_1.2_1: R_VDD_1.2.2 ; sheet VDD_1.2/Res_Set
NetC_3_VDD_3.3_1: R_VDD_3.3.2 ; sheet VDD_3.3/Res_Set
NetC_3_VREF_1.8_1: R_VREF_1.8.2 ; sheet VREF_1.8/Res_Set
NetC_3_VREF_2v_1: R_VREF_2v.2 ; sheet VREF_2v/Res_Set

### Notes on the sheet
- Supply
- 1.8 V
- 1.8V
- 1.2V
- 3.3V
- VOUT = 100uA * Res_Set
- LT3045
- +VDC = 5.0 V
- Reference
- 2V

### Library data of the parts
R_AVDD R_DVDD_HIGH R_EVDD R_VREF_1.8 = Res 18k 0.05% 0603: Resistor; Manufacturer_Name: Panasonic; Manufacturer_Part_Number: ERA-3VRW1802V; Datasheet Link: http://industrial.panasonic.com/cdbs/www-data/pdf/RDM0000/RDM0000C331.pdf; Height: 0.4mm; Supplier 1: Digi-Key; Supplier Part Number 1: 10-ERA-3VRW1802VCT-ND
R_DVDD R_VDD_1.2 = CMP-2003-04416-1: Manufacturer: Panasonic; Part Number: ERA8AEB123V
R_VDD_3.3 = CMP-2001-00630-1: Manufacturer: Panasonic; Part Number: ERA6AEB333V
R_VREF_2v = CMP-03412-016182-1: RES SMD 20K OHM 0.1% 1/10W 0603; Manufacturer: Yageo; Manufacturer Part Number: RT0603BRE0720KL; Power Rating: 0.1W; Resistance: 20KΩ; Value: 20KΩ; Tolerance: 0.001; Voltage Rating: 75V; Temperature Coefficient: 50 ppm/°C; Category: Res; Height: 0.55mm; Ipc Land Pattern Name: RESC16080X45; RoHS: TRUE; Device Class L3: Chip SMD Resistors; Composition: Thin Film; Lead Free: Yes; Octopart: https://octopart.com/rt0603bre0720kl-yageo-1390266; Temperature: -55°C to +155°C; Series: RT; Digikey Description: RES SMD 20K OHM 0.1% 1/10W 0603; Footprint Url: http://www.yageo.com/exep/pages/download/literatures/PYu-R_Mount_10.pdf; Temperature Range Low: -55°C; Package: RT0603; Device Class L2: Resistors; ComponentLink2URL: http://www.yageo.com/documents/recent/PYu-RT_1-to-0.01_RoHS_L_9.pdf; ComponentLink2Description: Datasheet; Device Class L1: Passive Components; Temperature Range High: +155°C; Automotive: No

## Sheet LDO_Pos.SchDoc
size A
Used 8 times, as channels Power/LDO_All/AVDD, Power/LDO_All/DVDD_HIGH, Power/LDO_All/EVDD, Power/LDO_All/DVDD, Power/LDO_All/VDD_3.3, Power/LDO_All/VREF_2v, Power/LDO_All/VREF_1.8, Power/LDO_All/VDD_1.2. Parts and nets are listed once, with the designators drawn on the sheet.
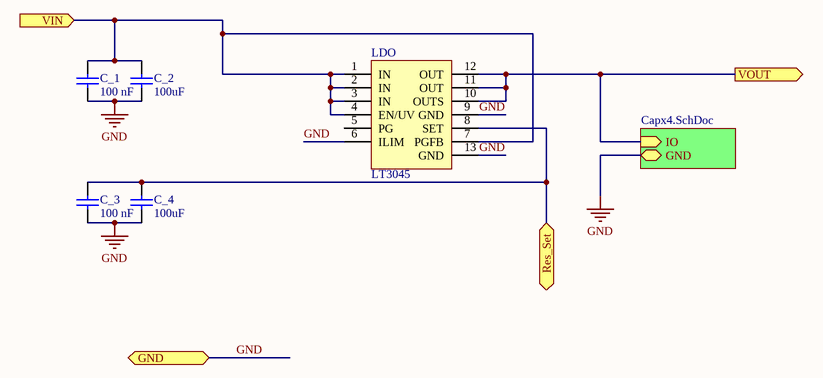
[diagram p7: LDO_Pos.SchDoc]

### Parts
C_1  value 100 nF  [KEMET C0805C104J8RACTU]  (hidden comment: Cap 100nF 0805)
C_2  value 100uF  [Taiyo Yuden JMK316ABJ107ML-T]  (hidden comment: Cap 100uF 1206)
C_3  value 100 nF  [KEMET C0805C104J8RACTU]  (hidden comment: Cap 100nF 0805)
C_4  value 100uF  [Taiyo Yuden JMK316ABJ107ML-T]  (hidden comment: Cap 100uF 1206)
LDO  LT3045  [ADI LT3045IMSE#PBF]

### Sub-sheets
U_Capx4 = Capx4.SchDoc: IO (in), GND (bidir)

### Ports
GND (bidir), Res_Set (bidir), VIN (in), VOUT (out)

### Nets
GND: C_1.2 C_2.2 C_3.2 C_4.2 LDO.6(ILIM) LDO.9(GND) LDO.13(GND) ; port GND, sheet U_Capx4/GND
Res_Set: C_3.1 C_4.1 LDO.8(SET) ; port Res_Set
VIN: C_1.1 C_2.1 LDO.1(IN) LDO.2(IN) LDO.3(IN) LDO.4(EN/UV) LDO.7(PGFB) ; port VIN
VOUT: LDO.10(OUTS) LDO.11(OUT) LDO.12(OUT) ; port VOUT, sheet U_Capx4/IO

Not connected (* = marked no-connect by the designer): LDO 5(PG)

### Channels
Power/LDO_All/AVDD: designators end in _AVDD; ports GND=DGND Res_Set=NetC_3_AVDD_1 VIN=+VDC_3.3_LDO VOUT=AVDD_LDO
Power/LDO_All/DVDD_HIGH: designators end in _DVDD_HIGH; ports GND=DGND Res_Set=NetC_3_DVDD_HIGH_1 VIN=+VDC_3.3_LDO VOUT=DVDD_HIGH_LDO
Power/LDO_All/EVDD: designators end in _EVDD; ports GND=DGND Res_Set=NetC_3_EVDD_1 VIN=+VDC_3.3_LDO VOUT=EVDD_LDO
Power/LDO_All/DVDD: designators end in _DVDD; ports GND=DGND Res_Set=NetC_3_DVDD_1 VIN=+VDC_1.8_LDO VOUT=DVDD_LDO
Power/LDO_All/VDD_3.3: designators end in _VDD_3.3; ports GND=DGND Res_Set=NetC_3_VDD_3.3_1 VIN=+VDC_LDO VOUT=VDD_3.3_LDO
Power/LDO_All/VREF_2v: designators end in _VREF_2v; ports GND=DGND Res_Set=NetC_3_VREF_2v_1 VIN=+VDC_3.3_LDO VOUT=VREF_2_LDO
Power/LDO_All/VREF_1.8: designators end in _VREF_1.8; ports GND=DGND Res_Set=NetC_3_VREF_1.8_1 VIN=+VDC_3.3_LDO VOUT=VREF_1.8_LDO
Power/LDO_All/VDD_1.2: designators end in _VDD_1.2; ports GND=DGND Res_Set=NetC_3_VDD_1.2_1 VIN=+VDC_1.8_LDO VOUT=VDD_1.2_LDO

### Library data of the parts
C_1 C_3 = Cap 100nF 0805: CAP CER 0.1UF 10V X7R 0805 / ±10% 10V Ceramic Capacitor X7R 0805 (2012 Metric); Supplier 1: Digi-Key; Supplier Part Number 1: 478-5311-1-ND
C_2 C_4 = Cap 100uF 1206: CAP CER 100UF 6.3V X5R 1206 / ±20% 6.3V Ceramic Capacitor X5R 1206 (3216 Metric); Published: 8-Jun-2000; LatestRevisionDate: 29-May-2009; LatestRevisionNote: IPC-7351 Footprint Added.; PackageReference: C1206; Publisher: Altium Limited; Supplier 1: RSComponents; Supplier Part Number 1: 7661078
LDO = LT3045: IC REG LINEAR 0V 500MA 12MSOP / Linear Voltage Regulator IC Output 500mA 12-MSOP-EP; Supplier 1: Digi-Key; Supplier Part Number 1: LT3045IMSE#PBF-ND; Supplier 2: Digi-Key; Supplier Part Number 2: 505-LT3045IMSE#PBF-ND

## Sheet Capx4.SchDoc
size A
Used 63 times, as channels Power/LDO_All/AVDD/U_Capx4, Power/LDO_All/DVDD_HIGH/U_Capx4, Power/LDO_All/EVDD/U_Capx4, Power/LDO_All/DVDD/U_Capx4, Power/LDO_All/VDD_3.3/U_Capx4, Power/LDO_All/VREF_2v/U_Capx4, Power/LDO_All/VREF_1.8/U_Capx4, Power/LDO_All/VDD_1.2/U_Capx4, Power/DAC/VREF_1.8_DAC, Power/DAC/AVDD_DAC, Power/DAC/EVDD_DAC, Power/DAC/DVDD_DAC, Power/DAC/DVDD_HI_DAC, Power/DAC/VREF_2_DAC, Power/DAC/VREF_DAC1, Power/DAC/VDC_DAC1, Power/DAC/VREF_DAC2, Power/DAC/VDC_DAC2, Power/DAC/VREF_DAC3, Power/DAC/VDC_DAC3, Power/DAC/VREF_DAC4, Power/DAC/VDC_DAC4, Power/DAC/VREF_DAC5, Power/DAC/VDC_DAC5, Power/DAC/VTAU1_DAC, Power/DAC/GCOMP_DAC, Power/DAC/EL_DAC, Power/DAC/GLDIST_DAC, Power/DAC/VTAU0_DAC, Power/DAC/VTAU2_DAC, Power/DAC/GLPROX_DAC, Power/DAC/VTAU3_DAC, Power/DAC/VB_BUFF_DAC, Power/DAC/VREFR_DAC, Power/DAC/VSS_SYN_DAC, Power/DAC/VAMP_LOW_DAC, Power/DAC/VBIAS_SF_DAC, Power/DAC/SYN_DRLO_DAC, Power/DAC/VAMP_HI_DAC, Power/DAC/VSPIKE_DAC, Power/DAC/VPDN_DAC, Power/DAC/V_EREV0_DAC, Power/DAC/V_EREV1_DAC, Power/DAC/V_EREV2_DAC, Power/DAC/V_EREV3_DAC, Power/DAC/VBIAS_DAC, Power/DAC/VRESET_DAC, Power/DAC/VTHRESH_DAC, Power/DAC/VBP_DAC, Power/DAC/WBIAS_HI_DAC, Power/DAC/WBIAS_LO_DAC, Power/DAC/IN_IBIAS_DAC, Power/DAC/WBIAS_DAC, Power/DAC/VpupReq_DAC, Power/DAC/Vpup_arb_DAC, Power/DAC/VDD_1.2_DAC, U_Sig_Acq/DVDD_ADC, U_Sig_Acq/REF_ADC, U_Sig_Acq/AVDD_ADC, BRK7010/+VDC_FPGA1, BRK7010/+VDC_FPGA2, BRK7010/+VDC_FPGA3, BRK7010/+VDC_FPGA4. Parts and nets are listed once, with the designators drawn on the sheet.
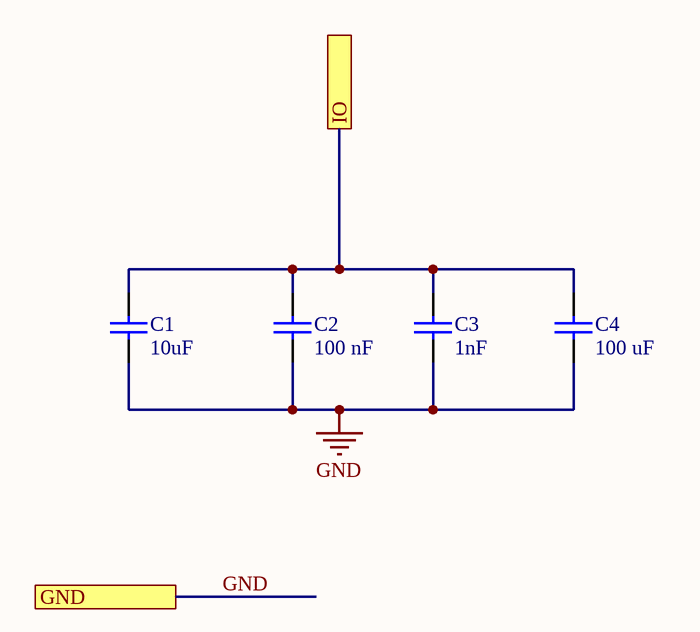
[diagram p8: Capx4.SchDoc]

### Parts
C1  value 10uF  [KEMET C0805C106K4PACTU]  (hidden comment: Cap 10uF 0805)
C2  value 100 nF  [KEMET C0805C104J8RACTU]  (hidden comment: Cap 100nF 0805)
C3  value 1nF  [Samsung CL21B Series]  (hidden comment: Cap 1nF 0805)
C4  value 100 uF  [KEMET C0805C104J8RACTU]  (hidden comment: Cap 100uF 0805)

### Ports
GND, IO

### Nets
GND: C1.2 C2.2 C3.2 C4.2 ; port GND
IO: C1.1 C2.1 C3.1 C4.1 ; port IO

### Channels
Power/LDO_All/AVDD/U_Capx4: designators end in _Power_LDO_All_AVDD_U_Capx4; ports GND=DGND IO=AVDD_LDO
Power/LDO_All/DVDD_HIGH/U_Capx4: designators end in _Power_LDO_All_DVDD_HIGH_U_Capx4; ports GND=DGND IO=DVDD_HIGH_LDO
Power/LDO_All/EVDD/U_Capx4: designators end in _Power_LDO_All_EVDD_U_Capx4; ports GND=DGND IO=EVDD_LDO
Power/LDO_All/DVDD/U_Capx4: designators end in _Power_LDO_All_DVDD_U_Capx4; ports GND=DGND IO=DVDD_LDO
Power/LDO_All/VDD_3.3/U_Capx4: designators end in _Power_LDO_All_VDD_3.3_U_Capx4; ports GND=DGND IO=VDD_3.3_LDO
Power/LDO_All/VREF_2v/U_Capx4: designators end in _Power_LDO_All_VREF_2v_U_Capx4; ports GND=DGND IO=VREF_2_LDO
Power/LDO_All/VREF_1.8/U_Capx4: designators end in _Power_LDO_All_VREF_1.8_U_Capx4; ports GND=DGND IO=VREF_1.8_LDO
Power/LDO_All/VDD_1.2/U_Capx4: designators end in _Power_LDO_All_VDD_1.2_U_Capx4; ports GND=DGND IO=VDD_1.2_LDO
Power/DAC/VREF_1.8_DAC: designators end in _VREF_1.8_DAC; ports GND=DGND IO=VREF_1.8_DAC
Power/DAC/AVDD_DAC: designators end in _AVDD_DAC; ports GND=DGND IO=AVDD_DAC
Power/DAC/EVDD_DAC: designators end in _EVDD_DAC; ports GND=DGND IO=EVDD_DAC
Power/DAC/DVDD_DAC: designators end in _DVDD_DAC; ports GND=DGND IO=DVDD_DAC
Power/DAC/DVDD_HI_DAC: designators end in _DVDD_HI_DAC; ports GND=DGND IO=DVDD_HIGH_DAC
Power/DAC/VREF_2_DAC: designators end in _VREF_2_DAC; ports GND=DGND IO=VREF_2_DAC
Power/DAC/VREF_DAC1: designators end in _VREF_DAC1; ports GND=DGND IO=DAC_VREF_INT
Power/DAC/VDC_DAC1: designators end in _VDC_DAC1; ports GND=DGND IO=+VDC_DAC1
Power/DAC/VREF_DAC2: designators end in _VREF_DAC2; ports GND=DGND IO=DAC_VREF_2
Power/DAC/VDC_DAC2: designators end in _VDC_DAC2; ports GND=DGND IO=+VDC_DAC
Power/DAC/VREF_DAC3: designators end in _VREF_DAC3; ports GND=DGND IO=DAC_VREF_2
Power/DAC/VDC_DAC3: designators end in _VDC_DAC3; ports GND=DGND IO=+VDC_DAC
Power/DAC/VREF_DAC4: designators end in _VREF_DAC4; ports GND=DGND IO=DAC_VREF_2
Power/DAC/VDC_DAC4: designators end in _VDC_DAC4; ports GND=DGND IO=+VDC_DAC
Power/DAC/VREF_DAC5: designators end in _VREF_DAC5; ports GND=DGND IO=DAC_VREF_1.8
Power/DAC/VDC_DAC5: designators end in _VDC_DAC5; ports GND=DGND IO=+VDC_DAC
Power/DAC/VTAU1_DAC: designators end in _VTAU1_DAC; ports GND=DGND IO=V_TAU1_DAC
Power/DAC/GCOMP_DAC: designators end in _GCOMP_DAC; ports GND=DGND IO=GCOMP_DAC
Power/DAC/EL_DAC: designators end in _EL_DAC; ports GND=DGND IO=ELEAK_DAC
Power/DAC/GLDIST_DAC: designators end in _GLDIST_DAC; ports GND=DGND IO=GLEAK_DISTAL_DAC
Power/DAC/VTAU0_DAC: designators end in _VTAU0_DAC; ports GND=DGND IO=V_TAU0_DAC
Power/DAC/VTAU2_DAC: designators end in _VTAU2_DAC; ports GND=DGND IO=V_TAU2_DAC
Power/DAC/GLPROX_DAC: designators end in _GLPROX_DAC; ports GND=DGND IO=GLEAK_PROXIMAL_DAC
Power/DAC/VTAU3_DAC: designators end in _VTAU3_DAC; ports GND=DGND IO=V_TAU3_DAC
Power/DAC/VB_BUFF_DAC: designators end in _VB_BUFF_DAC; ports GND=DGND IO=VBIAS_UNITYBUFFER_DAC
Power/DAC/VREFR_DAC: designators end in _VREFR_DAC; ports GND=DGND IO=VREFR_DAC
Power/DAC/VSS_SYN_DAC: designators end in _VSS_SYN_DAC; ports GND=DGND IO=VSS_SYN_DAC
Power/DAC/VAMP_LOW_DAC: designators end in _VAMP_LOW_DAC; ports GND=DGND IO=VAMP_LOW_DAC
Power/DAC/VBIAS_SF_DAC: designators end in _VBIAS_SF_DAC; ports GND=DGND IO=VBIAS_SF_DAC
Power/DAC/SYN_DRLO_DAC: designators end in _SYN_DRLO_DAC; ports GND=DGND IO=SYNAPSE_DRIVE_LOW_DAC
Power/DAC/VAMP_HI_DAC: designators end in _VAMP_HI_DAC; ports GND=DGND IO=VAMP_HIGH_DAC
Power/DAC/VSPIKE_DAC: designators end in _VSPIKE_DAC; ports GND=DGND IO=VSPIKE_DAC
Power/DAC/VPDN_DAC: designators end in _VPDN_DAC; ports GND=DGND IO=VPDN_DAC
Power/DAC/V_EREV0_DAC: designators end in _V_EREV0_DAC; ports GND=DGND IO=V_EREV0_DAC
Power/DAC/V_EREV1_DAC: designators end in _V_EREV1_DAC; ports GND=DGND IO=V_EREV1_DAC
Power/DAC/V_EREV2_DAC: designators end in _V_EREV2_DAC; ports GND=DGND IO=V_EREV2_DAC
Power/DAC/V_EREV3_DAC: designators end in _V_EREV3_DAC; ports GND=DGND IO=V_EREV3_DAC
Power/DAC/VBIAS_DAC: designators end in _VBIAS_DAC; ports GND=DGND IO=VBIAS_DAC
Power/DAC/VRESET_DAC: designators end in _VRESET_DAC; ports GND=DGND IO=VRESET_DAC
Power/DAC/VTHRESH_DAC: designators end in _VTHRESH_DAC; ports GND=DGND IO=VTHRESH_DAC
Power/DAC/VBP_DAC: designators end in _VBP_DAC; ports GND=DGND IO=VBP_DAC
Power/DAC/WBIAS_HI_DAC: designators end in _WBIAS_HI_DAC; ports GND=DGND IO=WIDTH_BIAS_HIGH_DAC
Power/DAC/WBIAS_LO_DAC: designators end in _WBIAS_LO_DAC; ports GND=DGND IO=WIDTH_BIAS_LOW_DAC
Power/DAC/IN_IBIAS_DAC: designators end in _IN_IBIAS_DAC; ports GND=DGND IO=VINPUT_CURRENT_BIAS_DAC
Power/DAC/WBIAS_DAC: designators end in _WBIAS_DAC; ports GND=DGND IO=WIDTH_BIAS_DAC
Power/DAC/VpupReq_DAC: designators end in _VpupReq_DAC; ports GND=DGND IO=VpupReq_DAC
Power/DAC/Vpup_arb_DAC: designators end in _Vpup_arb_DAC; ports GND=DGND IO=Vpup_arb_DAC
Power/DAC/VDD_1.2_DAC: designators end in _VDD_1.2_DAC; ports GND=DGND IO=VDD_1.2_DAC
U_Sig_Acq/DVDD_ADC: designators end in _DVDD_ADC; ports GND=DGND IO=+VDC_ADC
U_Sig_Acq/REF_ADC: designators end in _REF_ADC; ports GND=DGND IO=DAC_VREF_1.8
U_Sig_Acq/AVDD_ADC: designators end in _AVDD_ADC; ports GND=DGND IO=+VDC_ADC
BRK7010/+VDC_FPGA1: designators end in _+VDC_FPGA1; ports GND=DGND IO=+VDC
BRK7010/+VDC_FPGA2: designators end in _+VDC_FPGA2; ports GND=DGND IO=+VDC
BRK7010/+VDC_FPGA3: designators end in _+VDC_FPGA3; ports GND=DGND IO=+VDC_3.3
BRK7010/+VDC_FPGA4: designators end in _+VDC_FPGA4; ports GND=DGND IO=+VDC_1.8

### Library data of the parts
C1 = Cap 10uF 0805: CAP CER 10UF 16V X5R 0805 / ±10% 16V Ceramic Capacitor X5R 0805 (2012 Metric); Supplier 1: Digi-Key; Supplier Part Number 1: 399-4925-1-ND; Supplier 2: Digi-Key; Supplier Part Number 2: 399-11939-1-ND
C2 = Cap 100nF 0805: as C_1 on sheet LDO_Pos; Supplier 1: Digi-Key; Supplier Part Number 1: 478-5311-1-ND
C3 = Cap 1nF 0805: Ceramic Capacitor, Multilayer, Ceramic, 50V, 10% +Tol, 10% -Tol, X7R, 15% TC, 0.001uF, Surface Mount, 0805; Supplier 1: Digi-Key; Supplier Part Number 1: 1276-2424-1-ND
C4 = Cap 100uF 0805: 100 µF ±20% 6.3V Ceramic Capacitor X5R 0805 (2012 Metric); Supplier 1: Newark; Supplier Part Number 1: 58Y4653

## Sheet DAC.SchDoc
size C
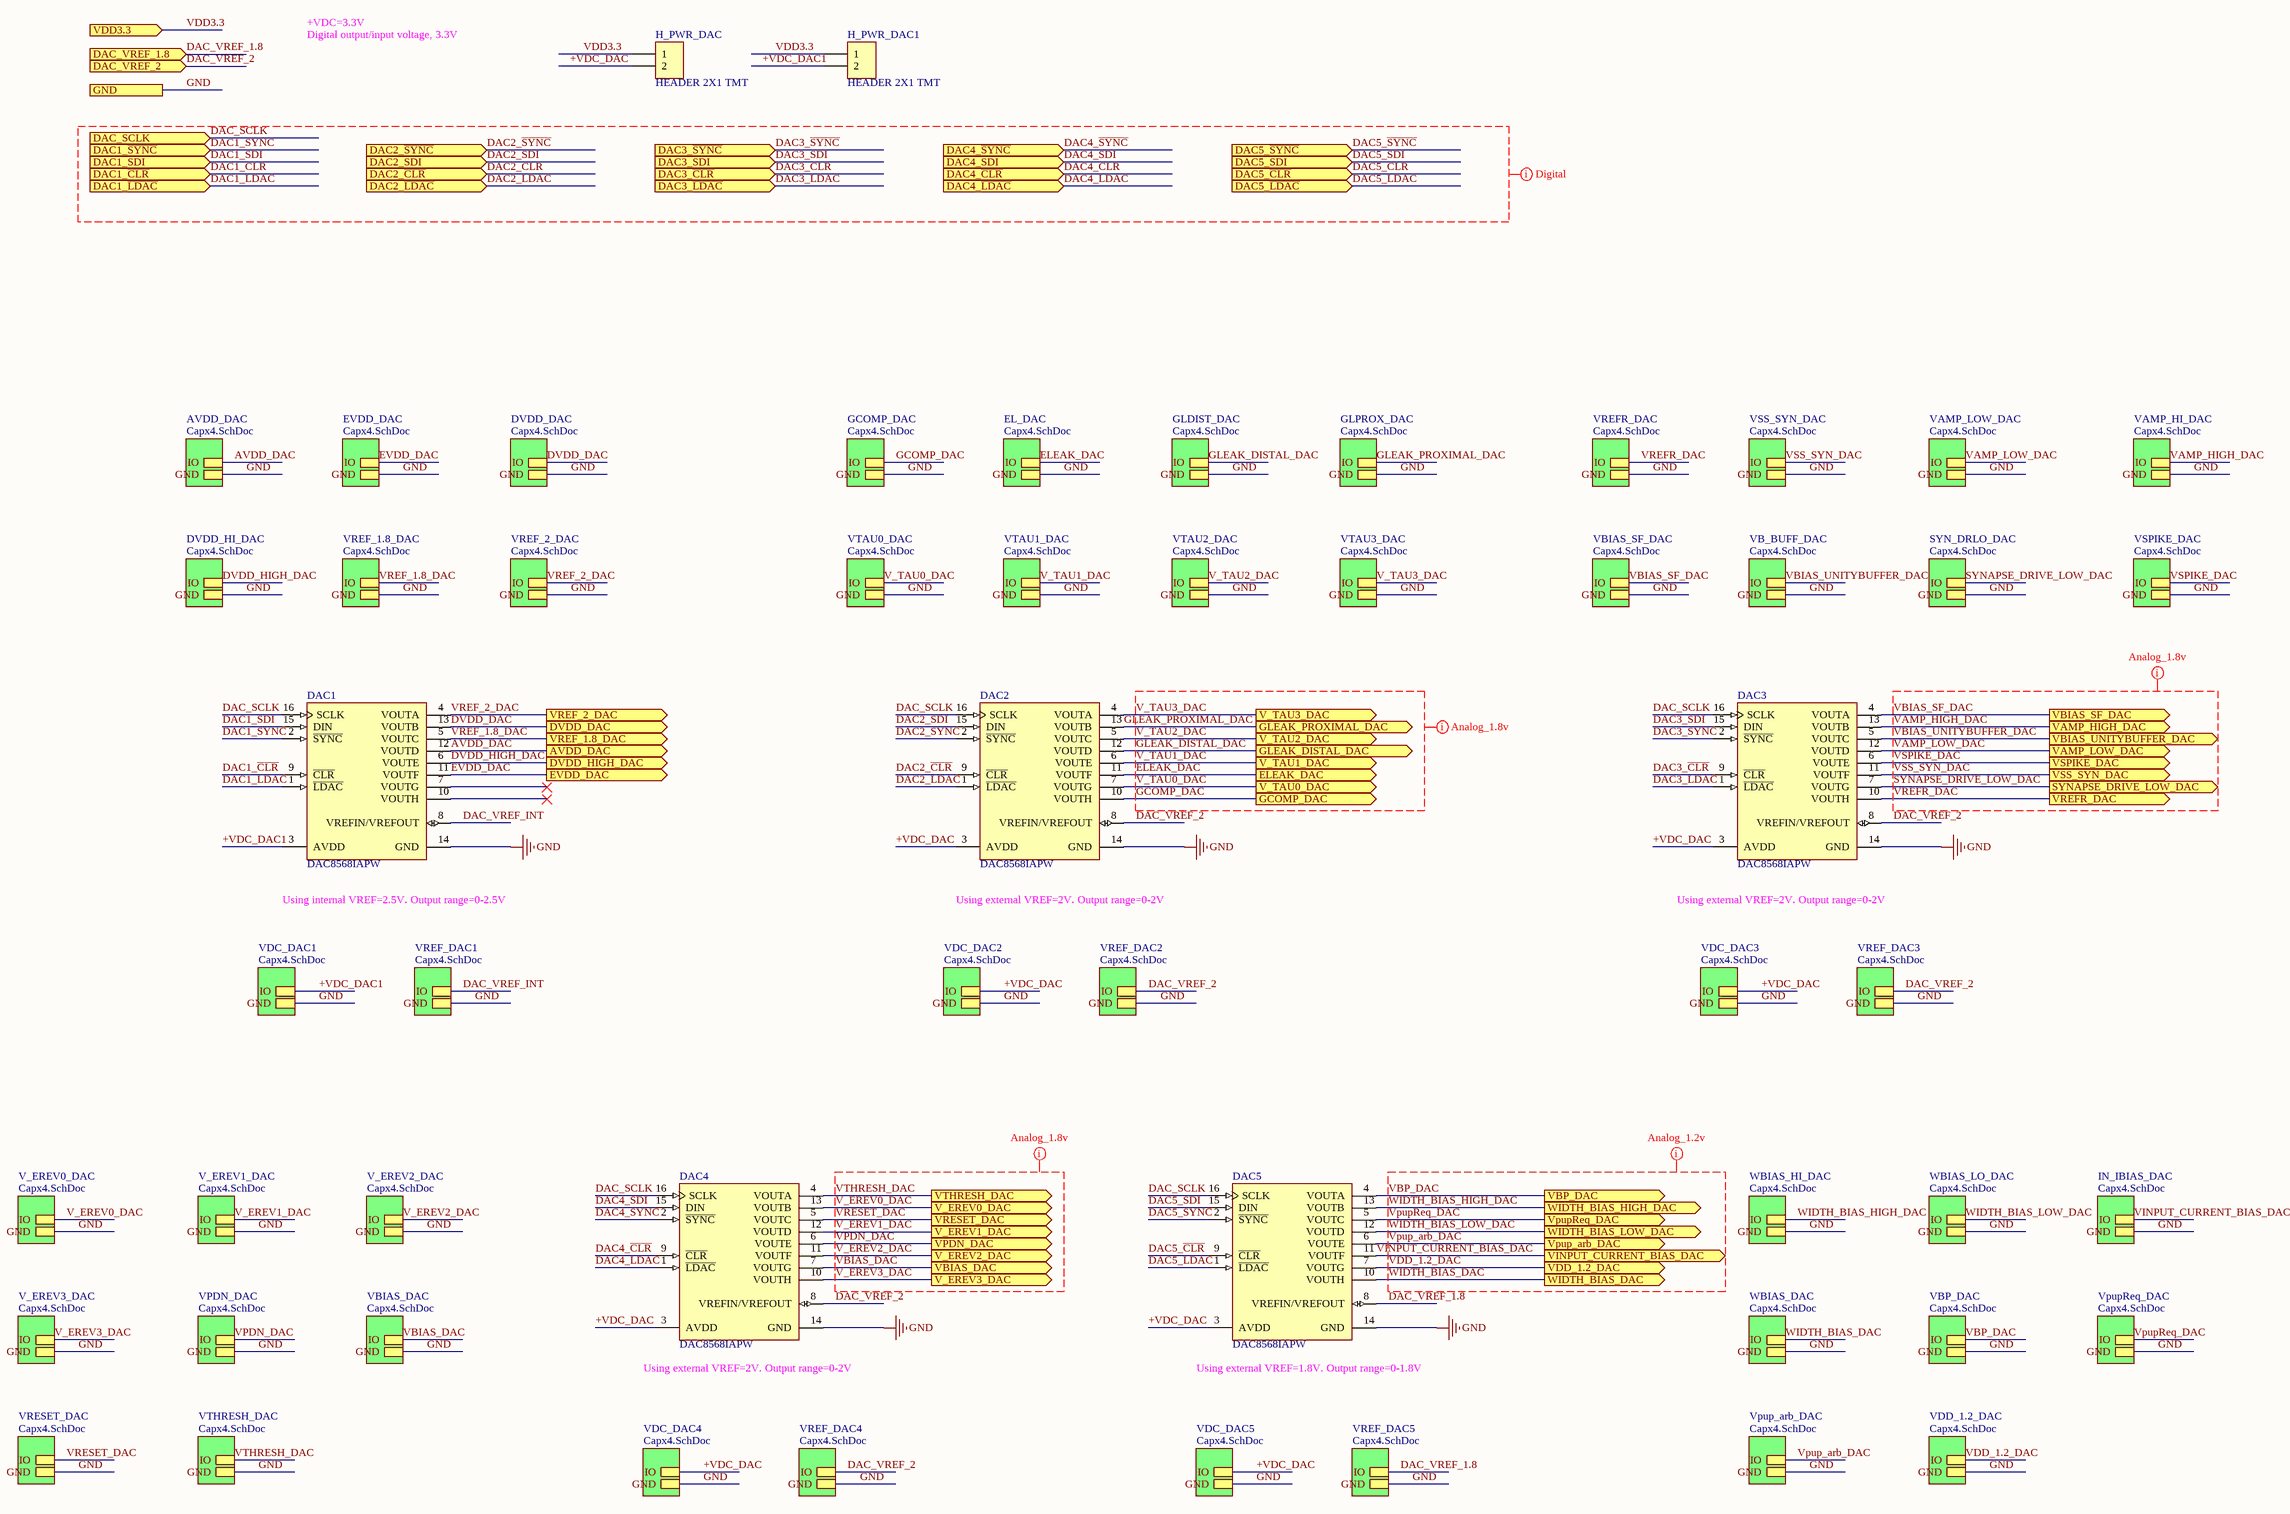
[diagram p9: DAC.SchDoc]

### Parts
DAC1  DAC8568IAPW  [TI-PW16_M]
DAC2  DAC8568IAPW  [TI-PW16_M]
DAC3  DAC8568IAPW  [TI-PW16_M]
DAC4  DAC8568IAPW  [TI-PW16_M]
DAC5  DAC8568IAPW  [TI-PW16_M]
H_PWR_DAC  HEADER 2X1 TMT  [Samtec TSW-102-07-G-S]
H_PWR_DAC1  HEADER 2X1 TMT  [Samtec TSW-102-07-G-S]

### Sub-sheets
AVDD_DAC = Capx4.SchDoc: IO, GND
DVDD_DAC = Capx4.SchDoc: IO, GND
DVDD_HI_DAC = Capx4.SchDoc: IO, GND
EL_DAC = Capx4.SchDoc: IO, GND
EVDD_DAC = Capx4.SchDoc: IO, GND
GCOMP_DAC = Capx4.SchDoc: IO, GND
GLDIST_DAC = Capx4.SchDoc: IO, GND
GLPROX_DAC = Capx4.SchDoc: IO, GND
IN_IBIAS_DAC = Capx4.SchDoc: IO, GND
SYN_DRLO_DAC = Capx4.SchDoc: IO, GND
V_EREV0_DAC = Capx4.SchDoc: IO, GND
V_EREV1_DAC = Capx4.SchDoc: IO, GND
V_EREV2_DAC = Capx4.SchDoc: IO, GND
V_EREV3_DAC = Capx4.SchDoc: IO, GND
VAMP_HI_DAC = Capx4.SchDoc: IO, GND
VAMP_LOW_DAC = Capx4.SchDoc: IO, GND
VB_BUFF_DAC = Capx4.SchDoc: IO, GND
VBIAS_DAC = Capx4.SchDoc: IO, GND
VBIAS_SF_DAC = Capx4.SchDoc: IO, GND
VBP_DAC = Capx4.SchDoc: IO, GND
VDC_DAC1 = Capx4.SchDoc: IO, GND
VDC_DAC2 = Capx4.SchDoc: IO, GND
VDC_DAC3 = Capx4.SchDoc: IO, GND
VDC_DAC4 = Capx4.SchDoc: IO, GND
VDC_DAC5 = Capx4.SchDoc: IO, GND
VDD_1.2_DAC = Capx4.SchDoc: IO, GND
VPDN_DAC = Capx4.SchDoc: IO, GND
Vpup_arb_DAC = Capx4.SchDoc: IO, GND
VpupReq_DAC = Capx4.SchDoc: IO, GND
VREF_1.8_DAC = Capx4.SchDoc: IO, GND
VREF_2_DAC = Capx4.SchDoc: IO, GND
VREF_DAC1 = Capx4.SchDoc: IO, GND
VREF_DAC2 = Capx4.SchDoc: IO, GND
VREF_DAC3 = Capx4.SchDoc: IO, GND
VREF_DAC4 = Capx4.SchDoc: IO, GND
VREF_DAC5 = Capx4.SchDoc: IO, GND
VREFR_DAC = Capx4.SchDoc: IO, GND
VRESET_DAC = Capx4.SchDoc: IO, GND
VSPIKE_DAC = Capx4.SchDoc: IO, GND
VSS_SYN_DAC = Capx4.SchDoc: IO, GND
VTAU0_DAC = Capx4.SchDoc: IO, GND
VTAU1_DAC = Capx4.SchDoc: IO, GND
VTAU2_DAC = Capx4.SchDoc: IO, GND
VTAU3_DAC = Capx4.SchDoc: IO, GND
VTHRESH_DAC = Capx4.SchDoc: IO, GND
WBIAS_DAC = Capx4.SchDoc: IO, GND
WBIAS_HI_DAC = Capx4.SchDoc: IO, GND
WBIAS_LO_DAC = Capx4.SchDoc: IO, GND

### Ports
AVDD_DAC (out), DAC1_SDI (in), DAC1_~{CLR} (in), DAC1_~{LDAC} (in), DAC1_~{SYNC} (in), DAC2_SDI (in), DAC2_~{CLR} (in), DAC2_~{LDAC} (in), DAC2_~{SYNC} (in), DAC3_SDI (in), DAC3_~{CLR} (in), DAC3_~{LDAC} (in), DAC3_~{SYNC} (in), DAC4_SDI (in), DAC4_~{CLR} (in), DAC4_~{LDAC} (in), DAC4_~{SYNC} (in), DAC5_SDI (in), DAC5_~{CLR} (in), DAC5_~{LDAC} (in), DAC5_~{SYNC} (in), DAC_SCLK (in), DAC_VREF_1.8 (in), DAC_VREF_2 (in), DVDD_DAC (out), DVDD_HIGH_DAC (out), ELEAK_DAC (out), EVDD_DAC (out), GCOMP_DAC (out), GLEAK_DISTAL_DAC (out), GLEAK_PROXIMAL_DAC (out), GND, SYNAPSE_DRIVE_LOW_DAC (out), V_EREV0_DAC (out), V_EREV1_DAC (out), V_EREV2_DAC (out), V_EREV3_DAC (out), V_TAU0_DAC (out), V_TAU1_DAC (out), V_TAU2_DAC (out), V_TAU3_DAC (out), VAMP_HIGH_DAC (out), VAMP_LOW_DAC (out), VBIAS_DAC (out), VBIAS_SF_DAC (out), VBIAS_UNITYBUFFER_DAC (out), VBP_DAC (out), VDD3.3 (in), VDD_1.2_DAC (out), VINPUT_CURRENT_BIAS_DAC (out), VPDN_DAC (out), Vpup_arb_DAC (out), VpupReq_DAC (out), VREF_1.8_DAC (out), VREF_2_DAC (out), VREFR_DAC (out), VRESET_DAC (out), VSPIKE_DAC (out), VSS_SYN_DAC (out), VTHRESH_DAC (out), WIDTH_BIAS_DAC (out), WIDTH_BIAS_HIGH_DAC (out), WIDTH_BIAS_LOW_DAC (out)

### Nets
GND: DAC1.14(GND) DAC2.14(GND) DAC3.14(GND) DAC4.14(GND) DAC5.14(GND) ; port GND, sheet VREF_1.8_DAC/GND, sheet AVDD_DAC/GND, sheet EVDD_DAC/GND, sheet DVDD_DAC/GND, sheet DVDD_HI_DAC/GND, sheet VREF_2_DAC/GND, sheet VREF_DAC1/GND, sheet VDC_DAC1/GND, sheet VREF_DAC2/GND, sheet VDC_DAC2/GND, sheet VREF_DAC3/GND, sheet VDC_DAC3/GND, sheet VREF_DAC4/GND, sheet VDC_DAC4/GND, sheet VREF_DAC5/GND, sheet VDC_DAC5/GND, sheet VTAU1_DAC/GND, sheet GCOMP_DAC/GND, sheet EL_DAC/GND, sheet GLDIST_DAC/GND, sheet VTAU0_DAC/GND, sheet VTAU2_DAC/GND, sheet GLPROX_DAC/GND, sheet VTAU3_DAC/GND, sheet VB_BUFF_DAC/GND, sheet VREFR_DAC/GND, sheet VSS_SYN_DAC/GND, sheet VAMP_LOW_DAC/GND, sheet VBIAS_SF_DAC/GND, sheet SYN_DRLO_DAC/GND, sheet VAMP_HI_DAC/GND, sheet VSPIKE_DAC/GND, sheet VPDN_DAC/GND, sheet V_EREV0_DAC/GND, sheet V_EREV1_DAC/GND, sheet V_EREV2_DAC/GND, sheet V_EREV3_DAC/GND, sheet VBIAS_DAC/GND, sheet VRESET_DAC/GND, sheet VTHRESH_DAC/GND, sheet VBP_DAC/GND, sheet WBIAS_HI_DAC/GND, sheet WBIAS_LO_DAC/GND, sheet IN_IBIAS_DAC/GND, sheet WBIAS_DAC/GND, sheet VpupReq_DAC/GND, sheet Vpup_arb_DAC/GND, sheet VDD_1.2_DAC/GND  [project net DGND]
+VDC_DAC: DAC2.3(AVDD) DAC3.3(AVDD) DAC4.3(AVDD) DAC5.3(AVDD) H_PWR_DAC.2 ; sheet VDC_DAC2/IO, sheet VDC_DAC3/IO, sheet VDC_DAC4/IO, sheet VDC_DAC5/IO
+VDC_DAC1: DAC1.3(AVDD) H_PWR_DAC1.2 ; sheet VDC_DAC1/IO
AVDD_DAC: DAC1.12(VOUTD) ; port AVDD_DAC, sheet AVDD_DAC/IO
DAC1_~{CLR}: DAC1.9(~{CLR}) ; port DAC1_~{CLR}
DAC1_~{LDAC}: DAC1.1(~{LDAC}) ; port DAC1_~{LDAC}
DAC1_~{SYNC}: DAC1.2(~{SYNC}) ; port DAC1_~{SYNC}
DAC1_SDI: DAC1.15(DIN) ; port DAC1_SDI
DAC2_~{CLR}: DAC2.9(~{CLR}) ; port DAC2_~{CLR}
DAC2_~{LDAC}: DAC2.1(~{LDAC}) ; port DAC2_~{LDAC}
DAC2_~{SYNC}: DAC2.2(~{SYNC}) ; port DAC2_~{SYNC}
DAC2_SDI: DAC2.15(DIN) ; port DAC2_SDI
DAC3_~{CLR}: DAC3.9(~{CLR}) ; port DAC3_~{CLR}
DAC3_~{LDAC}: DAC3.1(~{LDAC}) ; port DAC3_~{LDAC}
DAC3_~{SYNC}: DAC3.2(~{SYNC}) ; port DAC3_~{SYNC}
DAC3_SDI: DAC3.15(DIN) ; port DAC3_SDI
DAC4_~{CLR}: DAC4.9(~{CLR}) ; port DAC4_~{CLR}
DAC4_~{LDAC}: DAC4.1(~{LDAC}) ; port DAC4_~{LDAC}
DAC4_~{SYNC}: DAC4.2(~{SYNC}) ; port DAC4_~{SYNC}
DAC4_SDI: DAC4.15(DIN) ; port DAC4_SDI
DAC5_~{CLR}: DAC5.9(~{CLR}) ; port DAC5_~{CLR}
DAC5_~{LDAC}: DAC5.1(~{LDAC}) ; port DAC5_~{LDAC}
DAC5_~{SYNC}: DAC5.2(~{SYNC}) ; port DAC5_~{SYNC}
DAC5_SDI: DAC5.15(DIN) ; port DAC5_SDI
DAC_SCLK: DAC1.16(SCLK) DAC2.16(SCLK) DAC3.16(SCLK) DAC4.16(SCLK) DAC5.16(SCLK) ; port DAC_SCLK
DAC_VREF_1.8: DAC5.8(VREFIN/VREFOUT) ; port DAC_VREF_1.8, sheet VREF_DAC5/IO
DAC_VREF_2: DAC2.8(VREFIN/VREFOUT) DAC3.8(VREFIN/VREFOUT) DAC4.8(VREFIN/VREFOUT) ; port DAC_VREF_2, sheet VREF_DAC2/IO, sheet VREF_DAC3/IO, sheet VREF_DAC4/IO
DAC_VREF_INT: DAC1.8(VREFIN/VREFOUT) ; sheet VREF_DAC1/IO
DVDD_DAC: DAC1.13(VOUTB) ; port DVDD_DAC, sheet DVDD_DAC/IO
DVDD_HIGH_DAC: DAC1.6(VOUTE) ; port DVDD_HIGH_DAC, sheet DVDD_HI_DAC/IO
ELEAK_DAC: DAC2.11(VOUTF) ; port ELEAK_DAC, sheet EL_DAC/IO
EVDD_DAC: DAC1.11(VOUTF) ; port EVDD_DAC, sheet EVDD_DAC/IO
GCOMP_DAC: DAC2.10(VOUTH) ; port GCOMP_DAC, sheet GCOMP_DAC/IO
GLEAK_DISTAL_DAC: DAC2.12(VOUTD) ; port GLEAK_DISTAL_DAC, sheet GLDIST_DAC/IO
GLEAK_PROXIMAL_DAC: DAC2.13(VOUTB) ; port GLEAK_PROXIMAL_DAC, sheet GLPROX_DAC/IO
SYNAPSE_DRIVE_LOW_DAC: DAC3.7(VOUTG) ; port SYNAPSE_DRIVE_LOW_DAC, sheet SYN_DRLO_DAC/IO
V_EREV0_DAC: DAC4.13(VOUTB) ; port V_EREV0_DAC, sheet V_EREV0_DAC/IO
V_EREV1_DAC: DAC4.12(VOUTD) ; port V_EREV1_DAC, sheet V_EREV1_DAC/IO
V_EREV2_DAC: DAC4.11(VOUTF) ; port V_EREV2_DAC, sheet V_EREV2_DAC/IO
V_EREV3_DAC: DAC4.10(VOUTH) ; port V_EREV3_DAC, sheet V_EREV3_DAC/IO
V_TAU0_DAC: DAC2.7(VOUTG) ; port V_TAU0_DAC, sheet VTAU0_DAC/IO
V_TAU1_DAC: DAC2.6(VOUTE) ; port V_TAU1_DAC, sheet VTAU1_DAC/IO
V_TAU2_DAC: DAC2.5(VOUTC) ; port V_TAU2_DAC, sheet VTAU2_DAC/IO
V_TAU3_DAC: DAC2.4(VOUTA) ; port V_TAU3_DAC, sheet VTAU3_DAC/IO
VAMP_HIGH_DAC: DAC3.13(VOUTB) ; port VAMP_HIGH_DAC, sheet VAMP_HI_DAC/IO
VAMP_LOW_DAC: DAC3.12(VOUTD) ; port VAMP_LOW_DAC, sheet VAMP_LOW_DAC/IO
VBIAS_DAC: DAC4.7(VOUTG) ; port VBIAS_DAC, sheet VBIAS_DAC/IO
VBIAS_SF_DAC: DAC3.4(VOUTA) ; port VBIAS_SF_DAC, sheet VBIAS_SF_DAC/IO
VBIAS_UNITYBUFFER_DAC: DAC3.5(VOUTC) ; port VBIAS_UNITYBUFFER_DAC, sheet VB_BUFF_DAC/IO
VBP_DAC: DAC5.4(VOUTA) ; port VBP_DAC, sheet VBP_DAC/IO
VDD3.3: H_PWR_DAC.1 H_PWR_DAC1.1 ; port VDD3.3
VDD_1.2_DAC: DAC5.7(VOUTG) ; port VDD_1.2_DAC, sheet VDD_1.2_DAC/IO
VINPUT_CURRENT_BIAS_DAC: DAC5.11(VOUTF) ; port VINPUT_CURRENT_BIAS_DAC, sheet IN_IBIAS_DAC/IO
VPDN_DAC: DAC4.6(VOUTE) ; port VPDN_DAC, sheet VPDN_DAC/IO
Vpup_arb_DAC: DAC5.6(VOUTE) ; port Vpup_arb_DAC, sheet Vpup_arb_DAC/IO
VpupReq_DAC: DAC5.5(VOUTC) ; port VpupReq_DAC, sheet VpupReq_DAC/IO
VREF_1.8_DAC: DAC1.5(VOUTC) ; port VREF_1.8_DAC, sheet VREF_1.8_DAC/IO
VREF_2_DAC: DAC1.4(VOUTA) ; port VREF_2_DAC, sheet VREF_2_DAC/IO
VREFR_DAC: DAC3.10(VOUTH) ; port VREFR_DAC, sheet VREFR_DAC/IO
VRESET_DAC: DAC4.5(VOUTC) ; port VRESET_DAC, sheet VRESET_DAC/IO
VSPIKE_DAC: DAC3.6(VOUTE) ; port VSPIKE_DAC, sheet VSPIKE_DAC/IO
VSS_SYN_DAC: DAC3.11(VOUTF) ; port VSS_SYN_DAC, sheet VSS_SYN_DAC/IO
VTHRESH_DAC: DAC4.4(VOUTA) ; port VTHRESH_DAC, sheet VTHRESH_DAC/IO
WIDTH_BIAS_DAC: DAC5.10(VOUTH) ; port WIDTH_BIAS_DAC, sheet WBIAS_DAC/IO
WIDTH_BIAS_HIGH_DAC: DAC5.13(VOUTB) ; port WIDTH_BIAS_HIGH_DAC, sheet WBIAS_HI_DAC/IO
WIDTH_BIAS_LOW_DAC: DAC5.12(VOUTD) ; port WIDTH_BIAS_LOW_DAC, sheet WBIAS_LO_DAC/IO

Not connected (* = marked no-connect by the designer): DAC1 7(VOUTG)* 10(VOUTH)*

### Layout directives
mark named Digital: DAC1_SDI, DAC1_~{CLR}, DAC1_~{LDAC}, DAC1_~{SYNC}, DAC2_SDI, DAC2_~{CLR}, DAC2_~{LDAC}, DAC2_~{SYNC}, DAC3_SDI, DAC3_~{CLR}, DAC3_~{LDAC}, DAC3_~{SYNC}, DAC4_SDI, DAC4_~{CLR}, DAC4_~{LDAC}, DAC4_~{SYNC}, DAC5_SDI, DAC5_~{CLR}, DAC5_~{LDAC}, DAC5_~{SYNC}, DAC_SCLK
mark named Analog_1.8v: ELEAK_DAC, GCOMP_DAC, GLEAK_DISTAL_DAC, SYNAPSE_DRIVE_LOW_DAC, V_EREV0_DAC, V_EREV1_DAC, V_EREV2_DAC, V_EREV3_DAC, V_TAU0_DAC, V_TAU1_DAC, V_TAU2_DAC, V_TAU3_DAC, VAMP_HIGH_DAC, VAMP_LOW_DAC, VBIAS_DAC, VBIAS_SF_DAC, VBIAS_UNITYBUFFER_DAC, VPDN_DAC, VREFR_DAC, VRESET_DAC, VSPIKE_DAC, VSS_SYN_DAC, VTHRESH_DAC
mark named Analog_1.2v: VBP_DAC, VDD_1.2_DAC, Vpup_arb_DAC, VpupReq_DAC, WIDTH_BIAS_DAC, WIDTH_BIAS_HIGH_DAC, WIDTH_BIAS_LOW_DAC

### Notes on the sheet
- Digital output/input voltage, 3.3V
- +VDC=3.3V
- Using internal VREF=2.5V. Output range=0-2.5V
- Using external VREF=2V. Output range=0-2V
- (near DAC4) Using external VREF=2V. Output range=0-2V
- (near DAC5) Using external VREF=1.8V. Output range=0-1.8V

### Library data of the parts
DAC1-DAC5 = CMP-0004-01120-1: 16-Bit, Octal Channel, Ultra-Low Glitch, Voltage Output DAC with 2.5 V, 2 ppm/degC Internal Reference, -40 to 125 degC, 16-pin SOP (PW16), Green (RoHS & no Sb/Br); Manufacturer: Texas Instruments; Power Consumption(Typ)(mW): 2.2; SubFamily: Precision DAC (=<10MSPS); SFDR(dB): 63; Resolution(Bits): 16; INL(Max)(+/-LSB): 12; Interface: Serial SPI; DAC Channels: 8; DNL(Max)(+/-LSB): 1; SNR(dB): 83; Settling Time(us): 5; Mounting Technology: Surface Mount; ComponentLink1URL: http://www.ti.com/; PackageReference: PW16; ComponentLink1Description: Manufacturer URL; Eco-Plan: Green (RoHS & no Sb/Br); ComponentLink3URL: http://www.ti.com/lit/ml/mpds361/mpds361.pdf; DatasheetVersion: SBAS430D; PackageVersion: 4040064-4/G, 02/2011; PackageDescription: 16-Pin Plastic Small Outline, Body 5 x 4.4 mm, Pitch 0.65 mm; Code_JEDEC: MO-153; ComponentLink2Description: Datasheet; ComponentLink3Description: Package Specification; PartNumber: DAC8568IAPW; ComponentLink2URL: http://www.ti.com/general/docs/lit/getliterature.tsp?genericPartNumber=DAC8568&fileType=pdf
H_PWR_DAC H_PWR_DAC1 = HEADER 2X1 TMT: CONN HEADER VERT 2POS 2.54MM / Connector Header Through Hole 2 position 0.100" (2.54mm); Supplier 1: Digi-Key; Supplier Part Number 1: SAM1029-02-ND